# EAGLE design Battery_Monitoring_V3 (EAGLE 9.6.2)

## Sheet 1 of 3
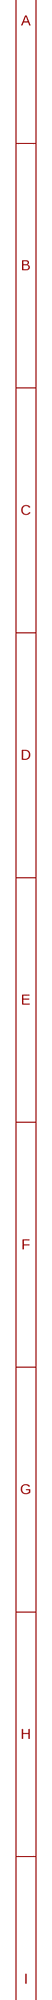
[diagram p0: schematic, sheet 1, part 1 of 2]
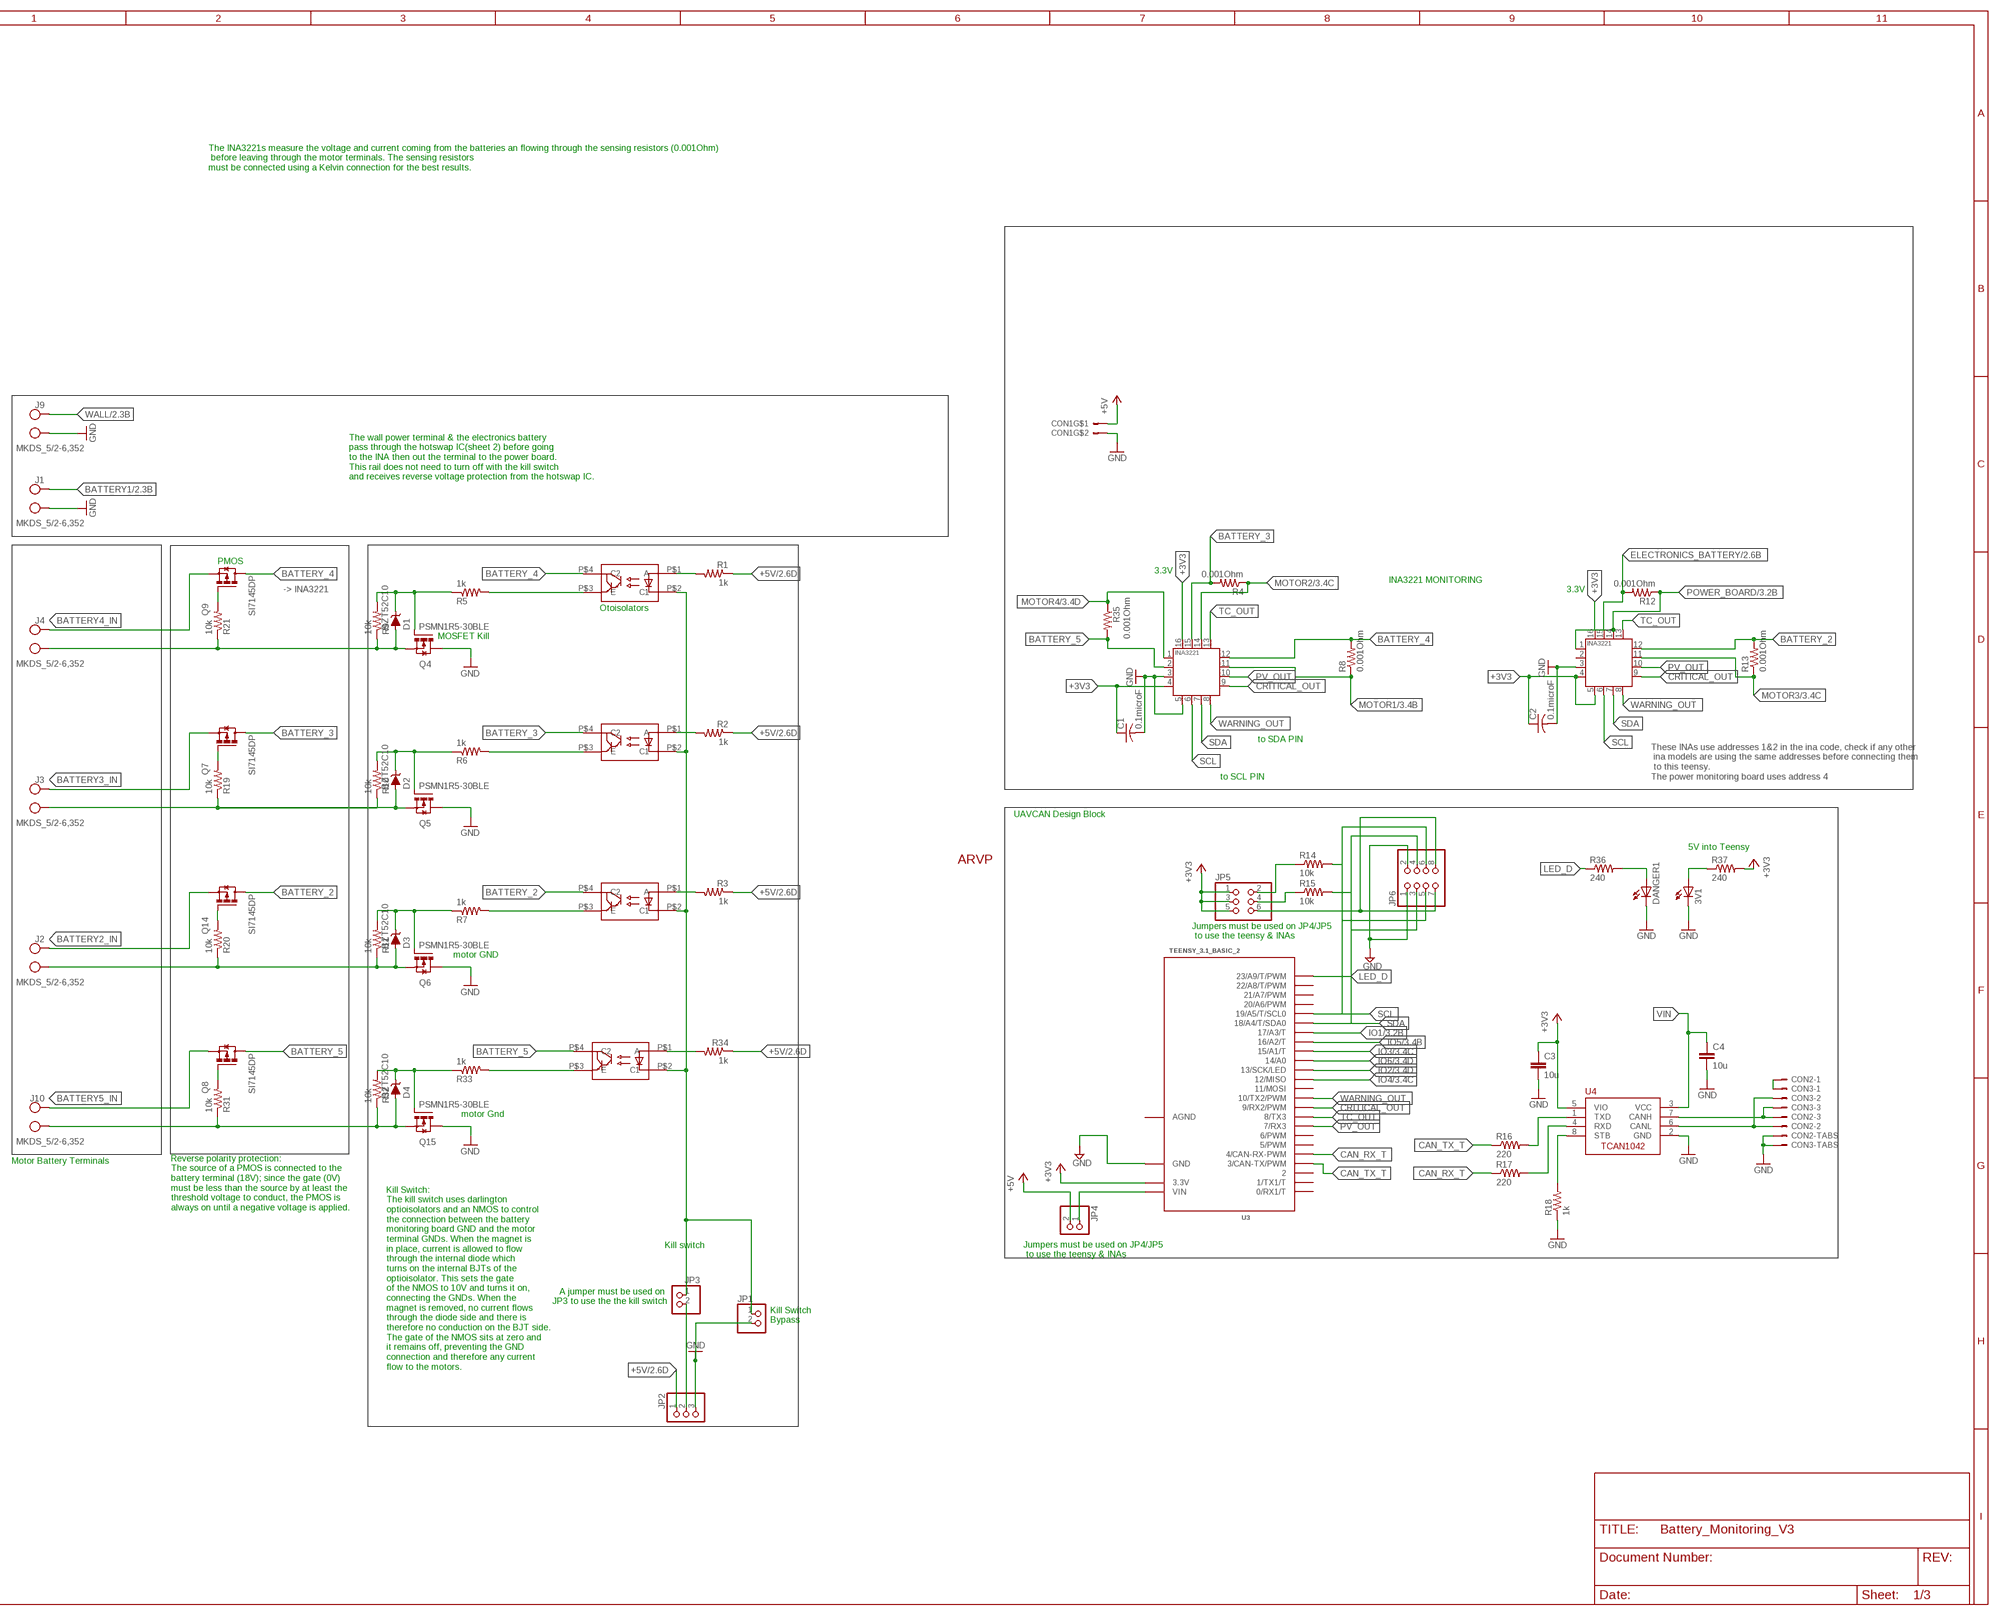
[diagram p1: schematic, sheet 1, part 2 of 2]

### Parts
3V1  LEDSMT1206  [1206]
ARVP1  ARVP_LOGO  [ARVP]
C1  0.1microF  C-USC2012  [C2012]
C2  0.1microF  C-USC2012  [C2012]
C3  10u  C-EUC0805  [C0805]
C4  10u  C-EUC0805  [C0805]
CON1  MOLEX_5566-2  [5566-2]
CON2  SM03B-GHS-TB  [SM03B-GHS-TB]
CON3  SM03B-GHS-TB  [SM03B-GHS-TB]
D1  BZT52C10  [SOD-123]
D2  BZT52C10  [SOD-123]
D3  BZT52C10  [SOD-123]
D4  BZT52C10  [SOD-123]
DANGER1  LEDSMT1206  [1206]
J1  MKDS_5/2-6,352  [MKDS_5/2-6,35]
J2  MKDS_5/2-6,352  [MKDS_5/2-6,35]
J3  MKDS_5/2-6,352  [MKDS_5/2-6,35]
J4  MKDS_5/2-6,352  [MKDS_5/2-6,35]
J9  MKDS_5/2-6,352  [MKDS_5/2-6,35]
J10  MKDS_5/2-6,352  [MKDS_5/2-6,35]
JP1  PINHD-1X2  [1X02]
JP2  PINHD-1X3  [1X03]
JP3  PINHD-1X2  [1X02]
JP4  PINHD-1X2  [1X02]
JP5  PINHD-2X3  [2X03]
JP6  PINHD-2X4  [2X04]
Q1  TCLD1000CT  [SOP-4L]
Q2  TCLD1000CT  [SOP-4L]
Q3  TCLD1000CT  [SOP-4L]
Q4  PSMN1R5-30BLE  [SOT404/D2PAK]
Q5  PSMN1R5-30BLE  [SOT404/D2PAK]
Q6  PSMN1R5-30BLE  [SOT404/D2PAK]
Q7  SI7145DP  [SO-8/PPAK/TEST]
Q8  SI7145DP  [SO-8/PPAK/TEST]
Q9  SI7145DP  [SO-8/PPAK/TEST]
Q14  SI7145DP  [SO-8/PPAK/TEST]
Q15  PSMN1R5-30BLE  [SOT404/D2PAK]
Q16  TCLD1000CT  [SOP-4L]
R1  1k  R-US_R0805  [R0805]
R2  1k  R-US_R0805  [R0805]
R3  1k  R-US_R0805  [R0805]
R4  0.001Ohm  HCS3920FT1L00  [3920]
R5  1k  R-US_M1206  [M1206]
R6  1k  R-US_M1206  [M1206]
R7  1k  R-US_M1206  [M1206]
R8  0.001Ohm  HCS3920FT1L00  [3920]
R9  10k  R-US_M1206  [M1206]
R10  10k  R-US_M1206  [M1206]
R11  10k  R-US_M1206  [M1206]
R12  0.001Ohm  HCS3920FT1L00  [3920]
R13  0.001Ohm  HCS3920FT1L00  [3920]
R14  10k  R-US_R1206  [R1206]
R15  10k  R-US_R1206  [R1206]
R16  220  R-US_R0805  [R0805]
R17  220  R-US_R0805  [R0805]
R18  1k  R-US_R0805  [R0805]
R19  10k  R-US_M1206  [M1206]
R20  10k  R-US_M1206  [M1206]
R21  10k  R-US_M1206  [M1206]
R31  10k  R-US_M1206  [M1206]
R32  10k  R-US_M1206  [M1206]
R33  1k  R-US_M1206  [M1206]
R34  1k  R-US_R0805  [R0805]
R35  0.001Ohm  HCS3920FT1L00  [3920]
R36  240  R-US_R1206  [R1206]
R37  240  R-US_R1206  [R1206]
U1  INA3221.  [HVQFN16_4X4]
U2  INA3221.  [HVQFN16_4X4]
U3  TEENSY_3.1_BASIC_2  [TEENSY_3.1_BASIC_2]
U4  TCAN1042HVDR  [SO-8]

### Nets
+3V3: C1.1 C2.1 C3.1 JP5.1 JP5.3 JP5.5 R37.2 U1.4(VS) U1.16(VPU) U2.4(VS) U2.5(A0) U2.16(VPU) U3.3.3V U4.5(VIO)
+5V: CON1.1 JP2.1 JP4.2 R1.1 R2.1 R3.1 R34.1 ; also sheet 2,3
BATT1GND: D1.P$2(A) J4.1(KL) Q4.3S(S) R9.1 R21.1
BATT2GND: D2.P$2(A) J3.1(KL) Q5.3S(S) R10.1 R19.1
BATT3GND: D3.P$2(A) J2.1(KL) Q6.3S(S) R11.1 R20.1
BATT5GND: D4.P$2(A) J10.1(KL) Q15.3S(S) R31.1 R32.1
BATTERY1: J1.2(KL1) ; also sheet 2
BATTERY2_IN: J2.2(KL1) Q14.S@1(S) Q14.S@2(S) Q14.S@3(S)
BATTERY3_IN: J3.2(KL1) Q7.S@1(S) Q7.S@2(S) Q7.S@3(S)
BATTERY4_IN: J4.2(KL1) Q9.S@1(S) Q9.S@2(S) Q9.S@3(S)
BATTERY5_IN: J10.2(KL1) Q8.S@1(S) Q8.S@2(S) Q8.S@3(S)
BATTERY_2: Q3.P$4(C2) Q14.D@1(D) Q14.D@2(D) Q14.D@3(D) Q14.D@4(D) Q14.D@5(D) R13.P$2 U2.12(IN+1)
BATTERY_3: Q2.P$4(C2) Q7.D@1(D) Q7.D@2(D) Q7.D@3(D) Q7.D@4(D) Q7.D@5(D) R4.P$2 U1.15(IN+2)
BATTERY_4: Q1.P$4(C2) Q9.D@1(D) Q9.D@2(D) Q9.D@3(D) Q9.D@4(D) Q9.D@5(D) R8.P$2 U1.12(IN+1)
BATTERY_5: Q8.D@1(D) Q8.D@2(D) Q8.D@3(D) Q8.D@4(D) Q8.D@5(D) Q16.P$4(C2) R35.P$2 U1.2(IN+3)
CAN_RX1: R17.2 U4.4(RXD)
CAN_RX_T: R17.1 U3.4(4/CAN-RX-PWM)
CAN_TX2: R16.2 U4.1(TXD)
CAN_TX_T: R16.1 U3.3(3/CAN-TX/PWM)
CANH1: CON2.P$3 CON3.P$3 U4.7(CANH)
CANL1: CON2.P$2 CON3.P$2 U4.6(CANL)
CANSH1: CON2.P$1 CON3.P$1
CRITICAL_OUT: U1.9(CRITICAL) U2.9(CRITICAL) U3.9(9/RX2/PWM)
E1: Q1.P$3(E) R5.2
E2: Q2.P$3(E) R6.2
E3: Q3.P$3(E) R7.2
ELECTRONICS_BATTERY: R12.P$2 U2.15(IN+2) ; also sheet 2
GND: 3V1.C C1.2 C2.2 C3.2 C4.2 CON1.2 CON2.P$4 CON2.P$5 CON3.P$4 CON3.P$5 DANGER1.C J1.1(KL) J9.1(KL) JP1.2 JP2.3 JP6.1 JP6.2 Q4.2D(D) Q5.2D(D) Q6.2D(D) Q15.2D(D) R18.1 U1.3(GND) U1.5(A0) U2.3(GND) U3.GND U4.2(GND) ; also sheet 2,3
I2C_3V1: JP5.6 JP6.7 JP6.8
IO1: U3.17/A3(17/A3/T) ; also sheet 3
IO2: U3.13(13/SCK/LED) ; also sheet 3
IO3: U3.15/A1(15/A1/T) ; also sheet 3
IO4: U3.12(12/MISO) ; also sheet 3
IO5: U3.16/A2(16/A2/T) ; also sheet 3
IO6: U3.14/A0 ; also sheet 3
LED_D: R36.1 U3.23/A9(23/A9/T/PWM)
MG1: D1.P$1(C) Q4.1G(G) R5.1 R9.2
MG2: D2.P$1(C) Q5.1G(G) R6.1 R10.2
MG3: D3.P$1(C) Q6.1G(G) R7.1 R11.2
MG4: D4.P$1(C) Q15.1G(G) R32.2 R33.1
MOTOR1: R8.P$1 U1.11(IN-1) ; also sheet 3
MOTOR2: R4.P$1 U1.14(IN-2) ; also sheet 3
MOTOR3: R13.P$1 U2.11(IN-1) ; also sheet 3
MOTOR4: R35.P$1 U1.1(IN-3) ; also sheet 3
N$1: Q1.P$1(A) R1.2
N$2: Q2.P$1(A) R2.2
N$3: Q3.P$1(A) R3.2
N$4: JP1.1 JP3.1 Q1.P$2(C1) Q2.P$2(C1) Q3.P$2(C1) Q16.P$2(C1)
N$5: JP2.2 JP3.2
N$6: Q7.G R19.2
N$7: Q14.G R20.2
N$9: Q9.G R21.2
N$10: Q8.G R31.2
N$15: Q16.P$3(E) R33.2
N$16: Q16.P$1(A) R34.2
N$22: 3V1.A R37.1
N$23: DANGER1.A R36.2
POWER_BOARD: R12.P$1 U2.1(IN-3) U2.14(IN-2) ; also sheet 3
PV_OUT: U1.10(PV) U2.10(PV) U3.7(7/RX3)
SCL: JP6.5 JP6.6 R14.2 U1.6(SCL) U2.6(SCL) U3.19/A5(19/A5/T/SCL0)
SCL_3V1: JP5.2 R14.1
SDA: JP6.3 JP6.4 R15.2 U1.7(SDA) U2.7(SDA) U3.18/A4(18/A4/T/SDA0)
SDA_3V1: JP5.4 R15.1
STB1: R18.2 U4.8(STB)
TC_OUT: U1.13(TC) U2.13(TC) U3.8(8/TX3)
VIN: C4.1 JP4.1 U3.VIN U4.3(VCC)
WALL: J9.2(KL1) ; also sheet 2
WARNING_OUT: U1.8(WARNING) U2.8(WARNING) U3.10(10/TX2/PWM)
Unconnected: U2.2(IN+3) U3.0(0/RX1/T) U3.1(1/TX1/T) U3.2 U3.5(5/PWM) U3.6(6/PWM) U3.11(11/MOSI) U3.20/A6(20/A6/PWM) U3.21/A7(21/A7/PWM) U3.22/A8(22/A8/T/PWM)

### Notes on the sheet
- The INA3221s measure the voltage and current coming from the batteries an flowing through the sensing resistors (0.001Ohm)
   before leaving through the motor terminals. The sensing resistors
  must be connected using a Kelvin connection for the best results.
- The wall power terminal & the electronics battery
  pass through the hotswap IC(sheet 2) before going 
  to the INA then out the terminal to the power board. 
  This rail does not need to turn off with the kill switch 
  and receives reverse voltage protection from the hotswap IC.
- PMOS
- 3.3V
- INA3221 MONITORING
- -> INA3221 | 3.3V
- Otoisolators
- MOSFET Kill
- to SDA PIN
- to SCL PIN
- These INAs use addresses 1&2 in the ina code, check if any other
   ina models are using the same addresses before connecting them
   to this teensy.
  The power monitoring board uses address 4
- UAVCAN Design Block
- 5V into Teensy
- Jumpers must be used on JP4/JP5
   to use the teensy & INAs
- motor GND
- motor Gnd
- Motor Battery Terminals
- Reverse polarity protection:
  The source of a PMOS is connected to the 
  battery terminal (18V); since the gate (0V) 
  must be less than the source by at least the 
  threshold voltage to conduct, the PMOS is 
  always on until a negative voltage is applied.
- Kill switch
- Jumpers must be used on JP4/JP5
   to use the teensy & INAs
- A jumper must be used on 
  JP3 to use the the kill switch
- Kill Switch 
  Bypass
- Kill Switch:
  The kill switch uses darlington 
  optioisolators and an NMOS to control 
  the connection between the battery 
  monitoring board GND and the motor 
  terminal GNDs. When the magnet is 
  in place, current is allowed to flow 
  through the internal diode which 
  turns on the internal BJTs of the 
  optioisolator. This sets the gate
  of the NMOS to 10V and turns it on,
  connecting the GNDs. When the 
  magnet is removed, no current flows 
  through the diode side and there is 
  therefore no conduction on the BJT side. 
  The gate of the NMOS sits at zero and 
  it remains off, preventing the GND 
  connection and therefore any current 
  flow to the motors.

## Sheet 2 of 3
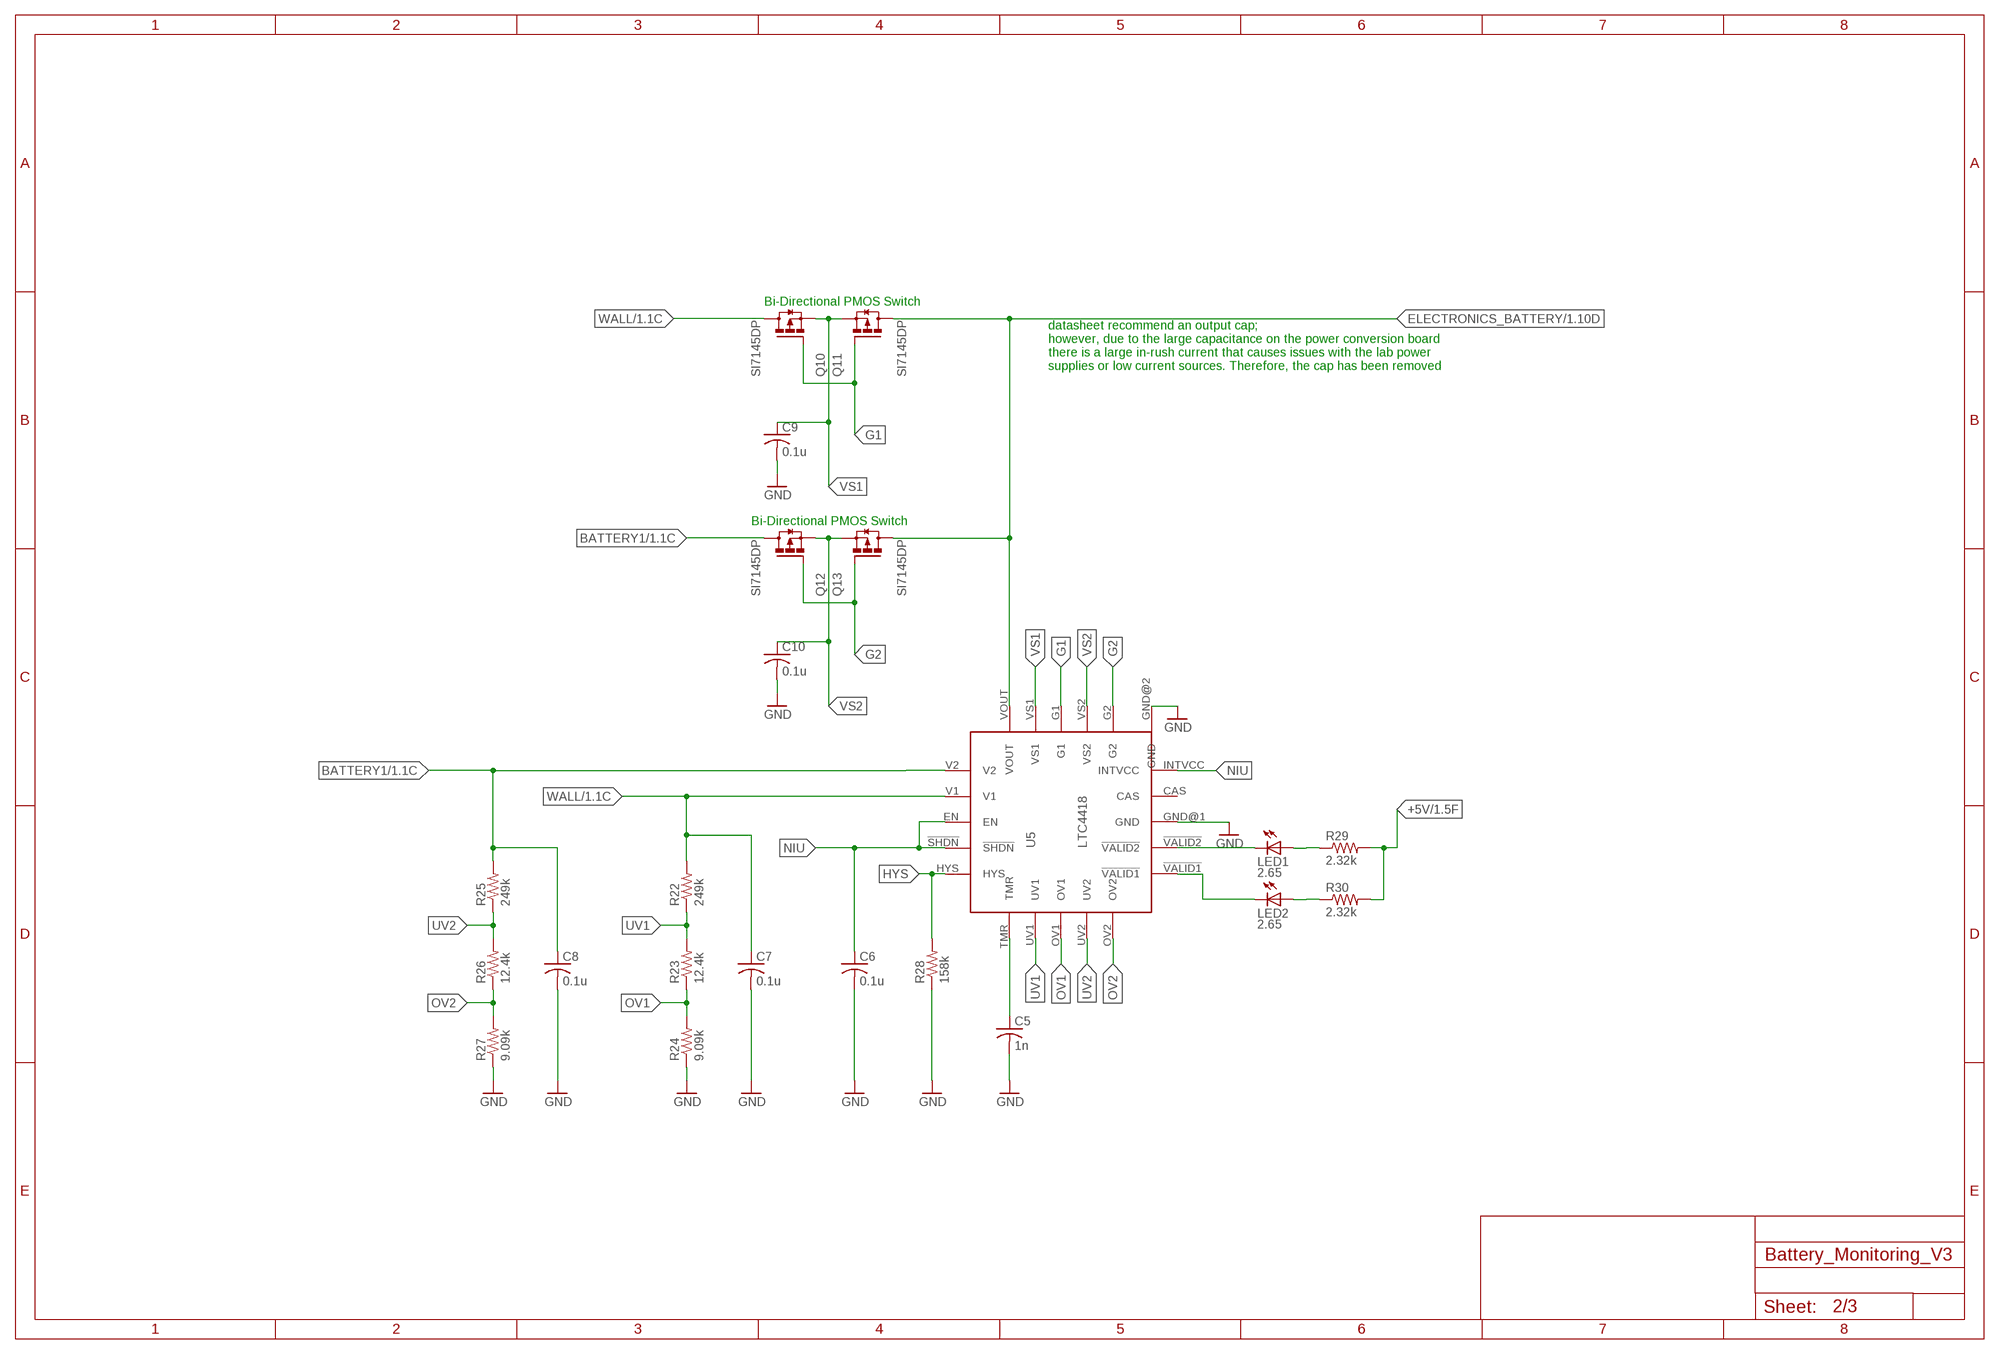
[diagram p2: schematic, sheet 2]

### Parts
C5  1n  C-USC0805  [C0805]
C6  0.1u  C-USC0805  [C0805]
C7  0.1u  C-USC0805  [C0805]
C8  0.1u  C-USC0805  [C0805]
C9  0.1u  C-USC0805  [C0805]
C10  0.1u  C-USC0805  [C0805]
LED1  2.65  LEDSML0805  [SML0805]
LED2  2.65  LEDSML0805  [SML0805]
Q10  SI7145DP  [SO-8/PPAK/TEST]
Q11  SI7145DP  [SO-8/PPAK/TEST]
Q12  SI7145DP  [SO-8/PPAK/TEST]
Q13  SI7145DP  [SO-8/PPAK/TEST]
R22  249k  R-US_R1206  [R1206]
R23  12.4k  R-US_R0805  [R0805]
R24  9.09k  R-US_R0805  [R0805]
R25  249k  R-US_R1206  [R1206]
R26  12.4k  R-US_R0805  [R0805]
R27  9.09k  R-US_R0805  [R0805]
R28  158k  R-US_R0805  [R0805]
R29  2.32k  R-US_R0805  [R0805]
R30  2.32k  R-US_R0805  [R0805]
U5  LTC4418  [20-QFN(4X4)]

### Nets
!VALID1: LED2.C U5.!VALID1
!VALID2: LED1.C U5.!VALID2
+5V: R29.2 R30.2 ; also sheet 1,3
BATTERY1: C8.1 Q12.D@1(D) Q12.D@2(D) Q12.D@3(D) Q12.D@4(D) Q12.D@5(D) R25.2 U5.V2 ; also sheet 1
ELECTRONICS_BATTERY: Q11.D@1(D) Q11.D@2(D) Q11.D@3(D) Q11.D@4(D) Q11.D@5(D) Q13.D@1(D) Q13.D@2(D) Q13.D@3(D) Q13.D@4(D) Q13.D@5(D) U5.VOUT ; also sheet 1
G1: Q10.G Q11.G U5.G1
G2: Q12.G Q13.G U5.G2
GND: C5.2 C6.2 C7.2 C8.2 C9.2 C10.2 R24.1 R27.1 R28.1 U5.GND@1(GND) U5.GND@2(GND) ; also sheet 1,3
HYS: R28.2 U5.HYS
N$8: LED1.A R29.1
N$11: LED2.A R30.1
N$14: C5.1 U5.TMR
NIU: C6.1 U5.!SHDN U5.EN U5.INTVCC
OV1: R23.1 R24.2 U5.OV1
OV2: R26.1 R27.2 U5.OV2
UV1: R22.1 R23.2 U5.UV1
UV2: R25.1 R26.2 U5.UV2
VS1: C9.1 Q10.S@1(S) Q10.S@2(S) Q10.S@3(S) Q11.S@1(S) Q11.S@2(S) Q11.S@3(S) U5.VS1
VS2: C10.1 Q12.S@1(S) Q12.S@2(S) Q12.S@3(S) Q13.S@1(S) Q13.S@2(S) Q13.S@3(S) U5.VS2
WALL: C7.1 Q10.D@1(D) Q10.D@2(D) Q10.D@3(D) Q10.D@4(D) Q10.D@5(D) R22.2 U5.V1 ; also sheet 1
Unconnected: U5.CAS

### Notes on the sheet
- Bi-Directional PMOS Switch
- datasheet recommend an output cap;
  however, due to the large capacitance on the power conversion board 
  there is a large in-rush current that causes issues with the lab power 
  supplies or low current sources. Therefore, the cap has been removed
- Bi-Directional PMOS Switch

## Sheet 3 of 3
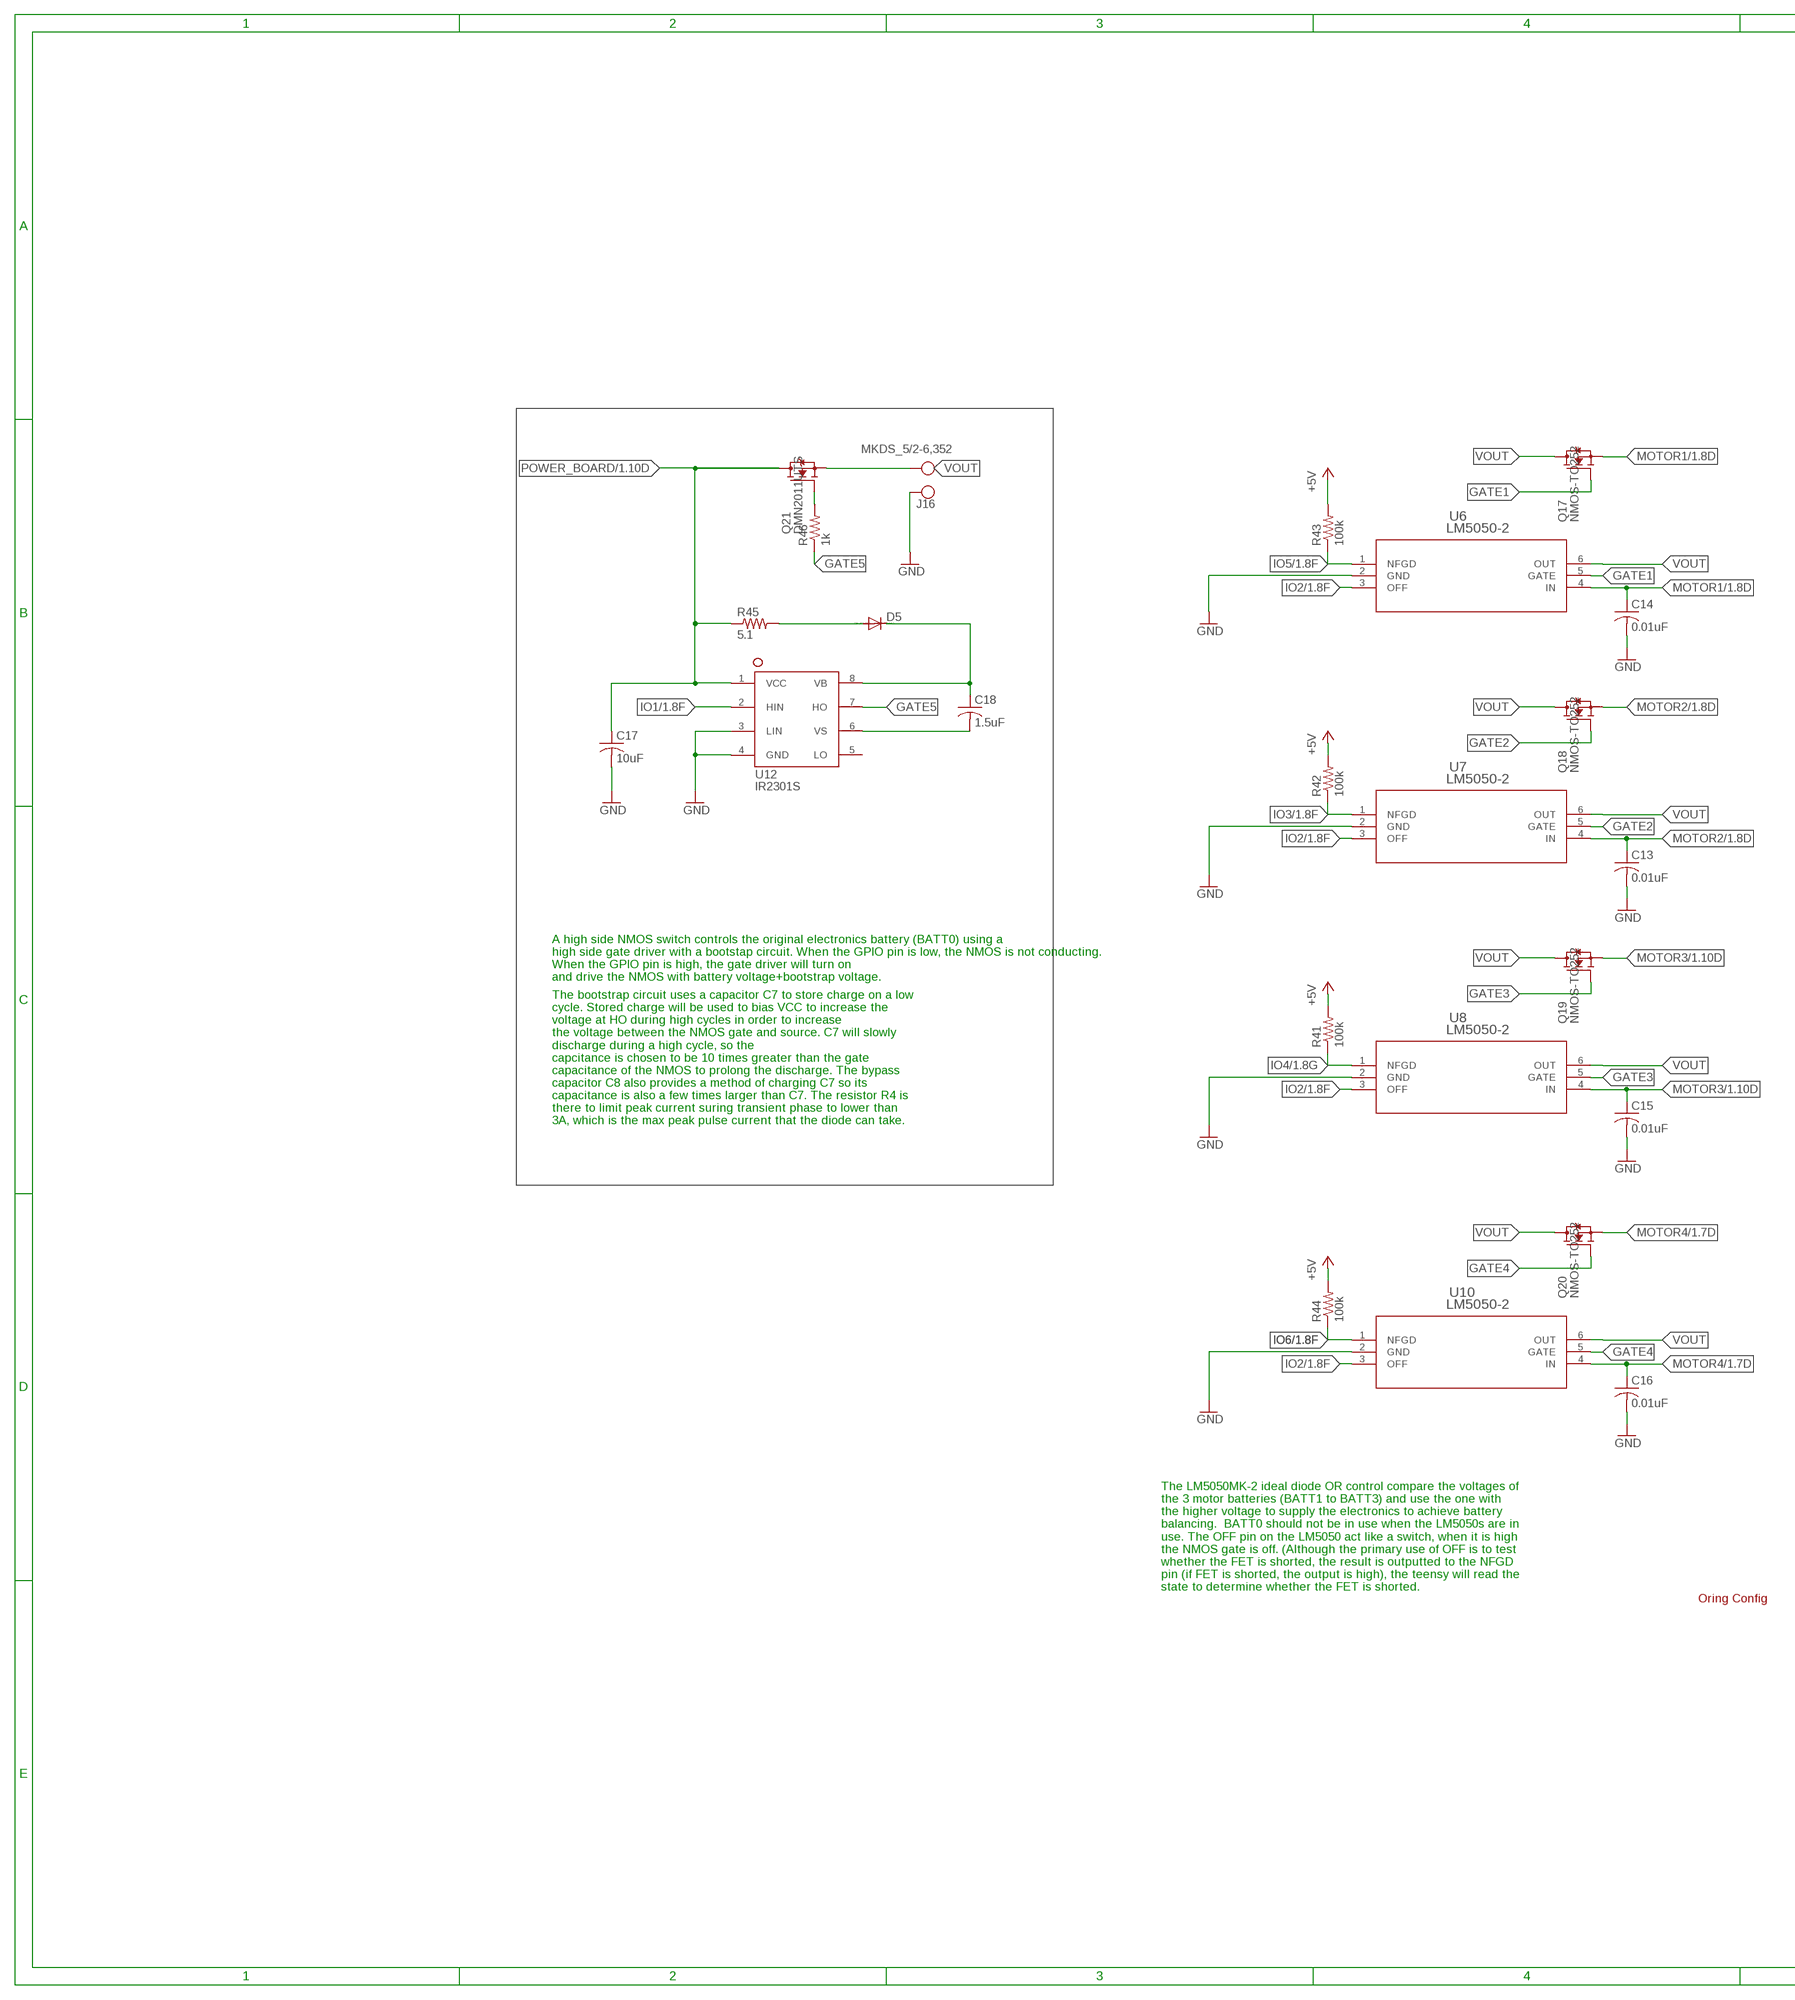
[diagram p3: schematic, sheet 3, part 1 of 2]
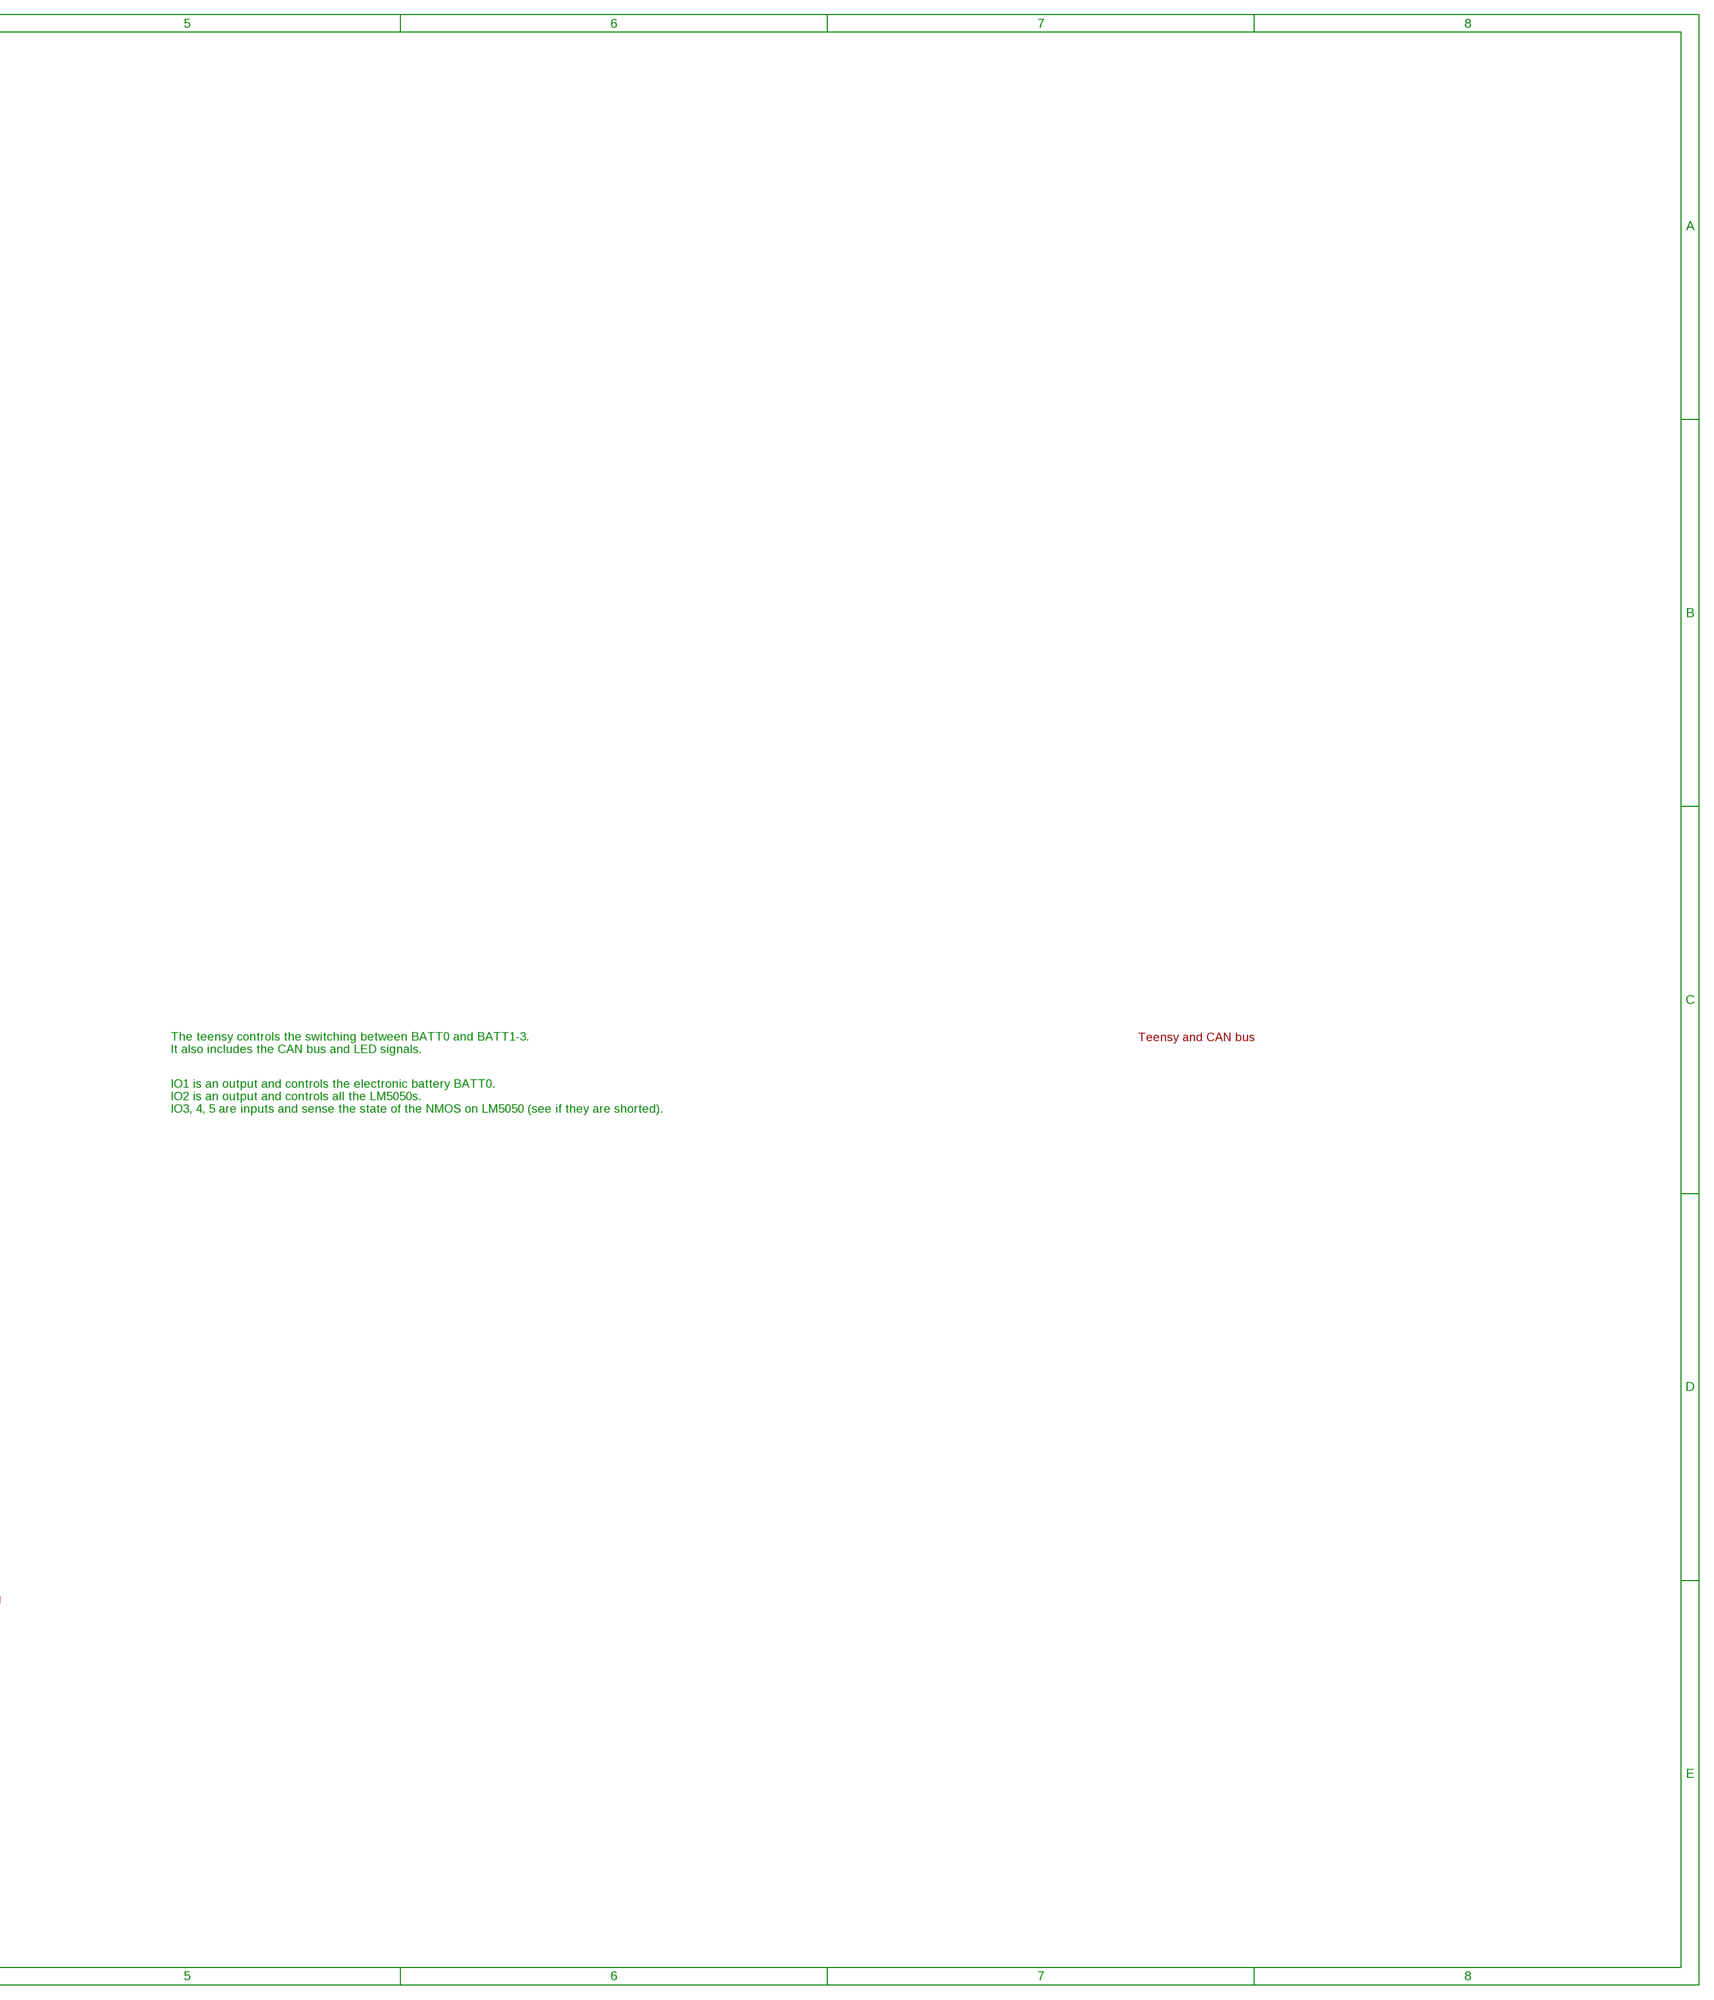
[diagram p4: schematic, sheet 3, part 2 of 2]

### Parts
C13  0.01uF  C-USC0805  [C0805]
C14  0.01uF  C-USC0805  [C0805]
C15  0.01uF  C-USC0805  [C0805]
C16  0.01uF  C-USC0805  [C0805]
C17  10uF  C-USC1206  [C1206]
C18  1.5uF  C-USC0805  [C0805]
D5  DIODE-DO-214AC  [DO-214AC]
J16  MKDS_5/2-6,352  [MKDS_5/2-6,35]
Q17  NMOS-TO252  [TO252]
Q18  NMOS-TO252  [TO252]
Q19  NMOS-TO252  [TO252]
Q20  NMOS-TO252  [TO252]
Q21  DMN2011UTS  [SOP65P640X120-8N]
R41  100k  R-US_R1206  [R1206]
R42  100k  R-US_R1206  [R1206]
R43  100k  R-US_R1206  [R1206]
R44  100k  R-US_R1206  [R1206]
R45  5.1  R-US_R1206  [R1206]
R46  1k  R-US_R0805  [R0805]
U6  LM5050-2  [MK06A]
U7  LM5050-2  [MK06A]
U8  LM5050-2  [MK06A]
U10  LM5050-2  [MK06A]
U12  IR2301S  [SOIC8]

### Nets
+5V: R41.2 R42.2 R43.2 R44.2 ; also sheet 1,2
GATE1: Q17.1(G) U6.5(GATE)
GATE2: Q18.1(G) U7.5(GATE)
GATE3: Q19.1(G) U8.5(GATE)
GATE4: Q20.1(G) U10.5(GATE)
GATE5: R46.1 U12.7(HO)
GND: C13.2 C14.2 C15.2 C16.2 C17.2 J16.2(KL1) U6.2(GND) U7.2(GND) U8.2(GND) U10.2(GND) U12.3(LIN) U12.4(GND) ; also sheet 1,2
IO1: U12.2(HIN) ; also sheet 1
IO2: U6.3(OFF) U7.3(OFF) U8.3(OFF) U10.3(OFF) ; also sheet 1
IO3: R42.1 U7.1(NFGD) ; also sheet 1
IO4: R41.1 U8.1(NFGD) ; also sheet 1
IO5: R43.1 U6.1(NFGD) ; also sheet 1
IO6: R44.1 U10.1(NFGD) ; also sheet 1
MOTOR1: C14.1 Q17.3(S) U6.4(IN) ; also sheet 1
MOTOR2: C13.1 Q18.3(S) U7.4(IN) ; also sheet 1
MOTOR3: C15.1 Q19.3(S) U8.4(IN) ; also sheet 1
MOTOR4: C16.1 Q20.3(S) U10.4(IN) ; also sheet 1
N$18: C18.2 U12.6(VS)
N$19: C18.1 D5.C U12.8(VB)
N$20: Q21.4(G) R46.2
N$21: D5.A R45.2
POWER_BOARD: C17.1 Q21.5(D) Q21.6(D) Q21.7(D) Q21.8(D) R45.1 U12.1(VCC) ; also sheet 1
VOUT: J16.1(KL) Q17.2(D) Q18.2(D) Q19.2(D) Q20.2(D) Q21.1(S) Q21.2(S) Q21.3(S) U6.6(OUT) U7.6(OUT) U8.6(OUT) U10.6(OUT)
Unconnected: U12.5(LO)

### Notes on the sheet
- A high side NMOS switch controls the original electronics battery (BATT0) using a
  high side gate driver with a bootstap circuit. When the GPIO pin is low, the NMOS is not conducting. 
  When the GPIO pin is high, the gate driver will turn on
  and drive the NMOS with battery voltage+bootstrap voltage.
- Teensy and CAN bus
- The teensy controls the switching between BATT0 and BATT1-3.
  It also includes the CAN bus and LED signals.
- IO1 is an output and controls the electronic battery BATT0.
  IO2 is an output and controls all the LM5050s.
  IO3, 4, 5 are inputs and sense the state of the NMOS on LM5050 (see if they are shorted).
- The bootstrap circuit uses a capacitor C7 to store charge on a low 
  cycle. Stored charge will be used to bias VCC to increase the
  voltage at HO during high cycles in order to increase 
  the voltage between the NMOS gate and source. C7 will slowly 
  discharge during a high cycle, so the
  capcitance is chosen to be 10 times greater than the gate
  capacitance of the NMOS to prolong the discharge. The bypass
  capacitor C8 also provides a method of charging C7 so its
  capacitance is also a few times larger than C7. The resistor R4 is
  there to limit peak current suring transient phase to lower than
  3A, which is the max peak pulse current that the diode can take.
- The LM5050MK-2 ideal diode OR control compare the voltages of
  the 3 motor batteries (BATT1 to BATT3) and use the one with
  the higher voltage to supply the electronics to achieve battery
  balancing.  BATT0 should not be in use when the LM5050s are in
  use. The OFF pin on the LM5050 act like a switch, when it is high
  the NMOS gate is off. (Although the primary use of OFF is to test
  whether the FET is shorted, the result is outputted to the NFGD
  pin (if FET is shorted, the output is high), the teensy will read the
  state to determine whether the FET is shorted.
- Oring Config

## Power pins joined to a net without a drawn wire
AGND: U3.AGND

## Library data of the parts
3V1 DANGER1 = adafruit:LED: LED
ARVP1 = ARVP:ARVP_LOGO
C1 C2 = resistor:C-US: CAPACITOR, American symbol
C3 C4 = rcl:C-EU: CAPACITOR, European symbol
C5-C10 C13-C18 = adafruit:C-US: CAPACITOR, American symbol
CON1 = ARVP:MOLEX_5566-2
CON2 CON3 = ARVP:SM03B-GHS-TB
D1-D4 = Moira:BZT52C10: DIODE ZENER 10V 500MW SOD123 by Diodes Incorporated Digikey: BZT52C10-FDICT-ND
D5 = diode:DIODE-: DIODE
J1-J4 J9 J10 J16 = Moira:MKDS_5/2-6,35: CONN TERM BLOCK 2POS 6.35MM PCB, 2 Position Wire to Board Terminal Block Horizontal with Board 0.250" (6.35mm) Through Hole, Phoenix Contact (1714955), Digikey:277-1269-ND, MKDS 5/2-6,35 package adpated from Eagle library package MKDS 5/3-6,35
JP1 JP3 JP4 = pinhead:PINHD-1X2: PIN HEADER
JP2 = pinhead:PINHD-1X3: PIN HEADER
JP5 = pinhead:PINHD-2X3: PIN HEADER
JP6 = pinhead:PINHD-2X4: PIN HEADER
LED1 LED2 = led:LED: LED
Q1 = Moira:TCLD1000CT: OPTOISOLTR 5KV DARLINGTON 4-SOP by VISHAY Digikey: TCLD1000CT_ND; SPICEPREFIX: E
Q2 Q3 Q16 = Moira:TCLD1000CT: OPTOISOLTR 5KV DARLINGTON 4-SOP by VISHAY Digikey: TCLD1000CT_ND
Q4-Q6 Q15 = Moira:PSMN1R5-30BLE: N-channel 30 V 1.5 mΩ logic level MOSFET in D2PAK by Nexperia USA Inc. Digikey: 1727-1101-1-ND
Q7-Q9 Q14 = Si7145DP:SI7145DP: MOSFET P-CH 30V 60A PPAK SO-8 Digikey: SI7145DP-T1-GE3CT-ND; MPN: SI7145DP-T1-GE3; OC_NEWARK: 63R6006
Q10-Q13 = Moira:SI7145DP: MOSFET P-CH 30V 60A PPAK SO-8 Digikey: SI7145DP-T1-GE3CT-ND
Q17-Q20 = AlbertaSat:NMOS-TO252
Q21 = Lydia:DMN2011UTS: MOSFET N-CH 20V 21A 8-TSSOP 20V 21A (Tc) 1.3W (Ta)
R1-R3 R5-R7 R9-R11 R22-R30 R32-R34 R41-R45 = adafruit:R-US_: RESISTOR, American symbol
R4 R8 R12 R13 R35 = Moira:HCS3920: 0.001 Ohm ±1% 5W Chip Resistor 4020 Automotive AEC-Q200, Current Sense, Moisture Resistant Metal Element Stackpole Electronics Inc. Digikey: HCS3920FT1L00CT-ND
R14-R18 R46 = rcl:R-US_: RESISTOR, American symbol
R19-R21 R31 = adafruit:R-US_: RESISTOR, American symbol; MPN: RC0603FR-0710KL; OC_NEWARK: 68R0049
R36 R37 = resistor:R-US_: RESISTOR, American symbol
U1 U2 = INA3221:INA3221: The INA3221 is a three-channel, high-side current and bus voltage monitor with an I 2C- and SMBUScompatible interface. The INA3221 monitors both shunt voltage drops and bus supply voltages, in addition to having programmable conversion times and averaging modes for these signals. The INA3221 offers both critical and warning alerts to detect multiple programmable out-of-range conditions for each channel.
U3 = Teensy_3_Series_Board_v1.0:TEENSY_3.1_BASIC_2: Footprint for Teensy 3.1 board using all pin connections on the outer perimeter
U4 = ARVP:TCAN1042HVDR
U5 = Moira:LTC4418: OR Controller Source Selector Switch P-Channel 2:1 20-QFN (4x4) Digikey: LTC4418IUF#PBF-ND
U6-U8 U10 = AlbertaSat:LM5050-2
U12 = Lydia:IR2301S

## Net classes
1 net1: clearance 0.203 mm to class 0

## Board
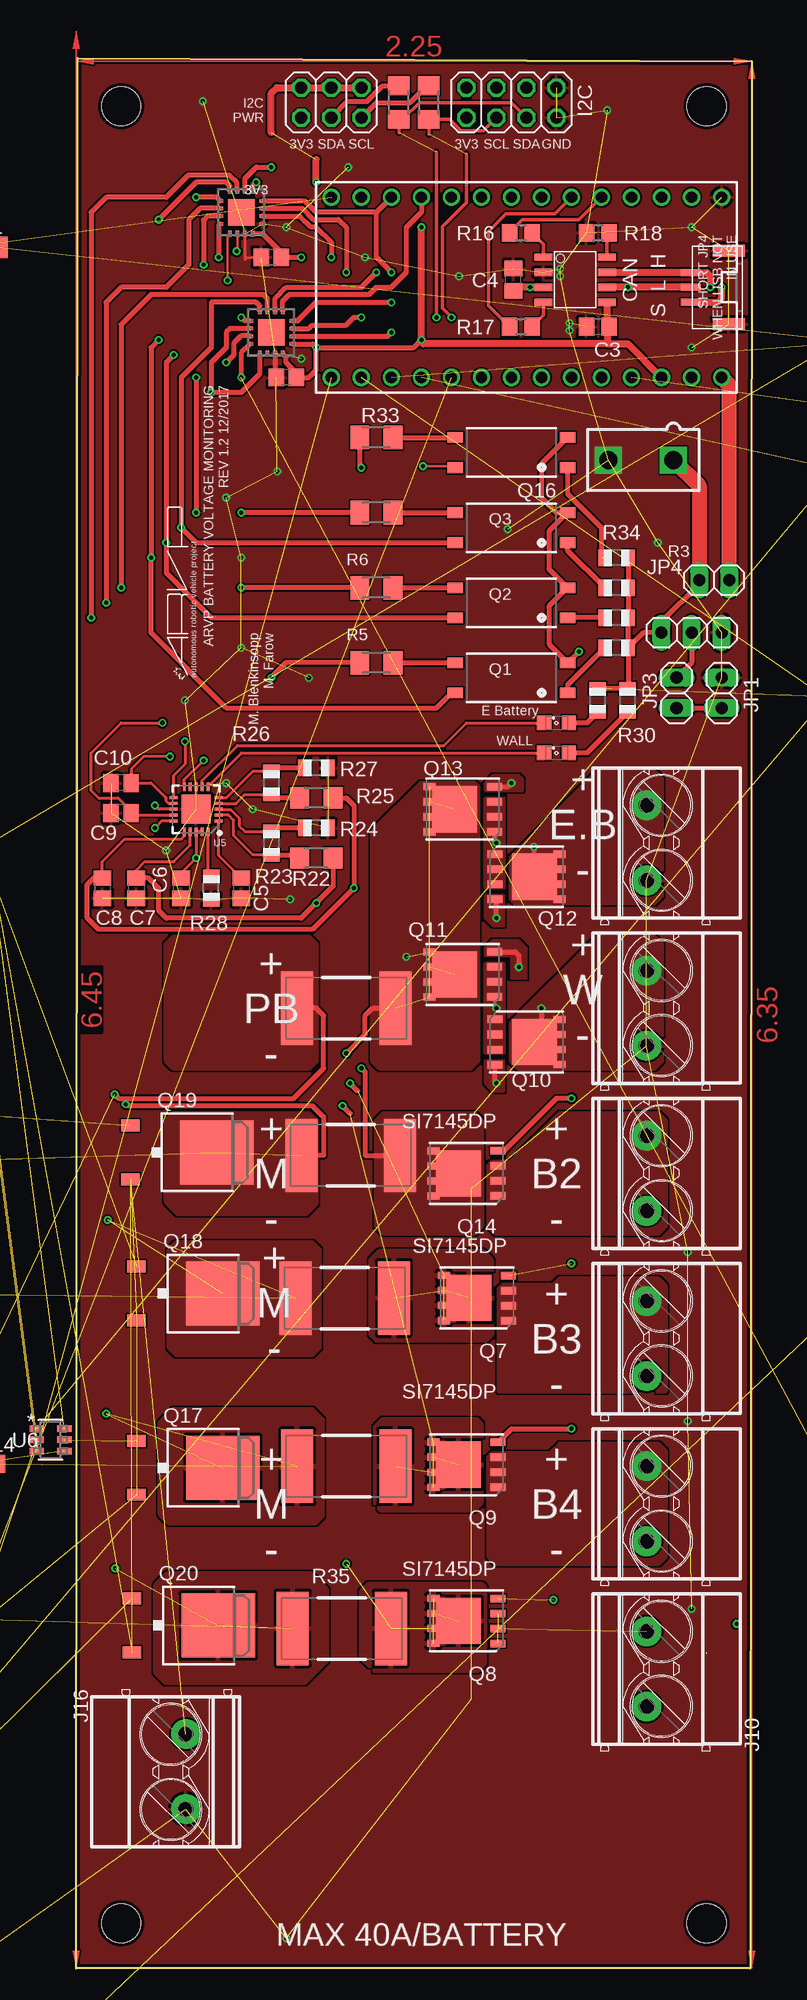
[diagram p5: board, top side]
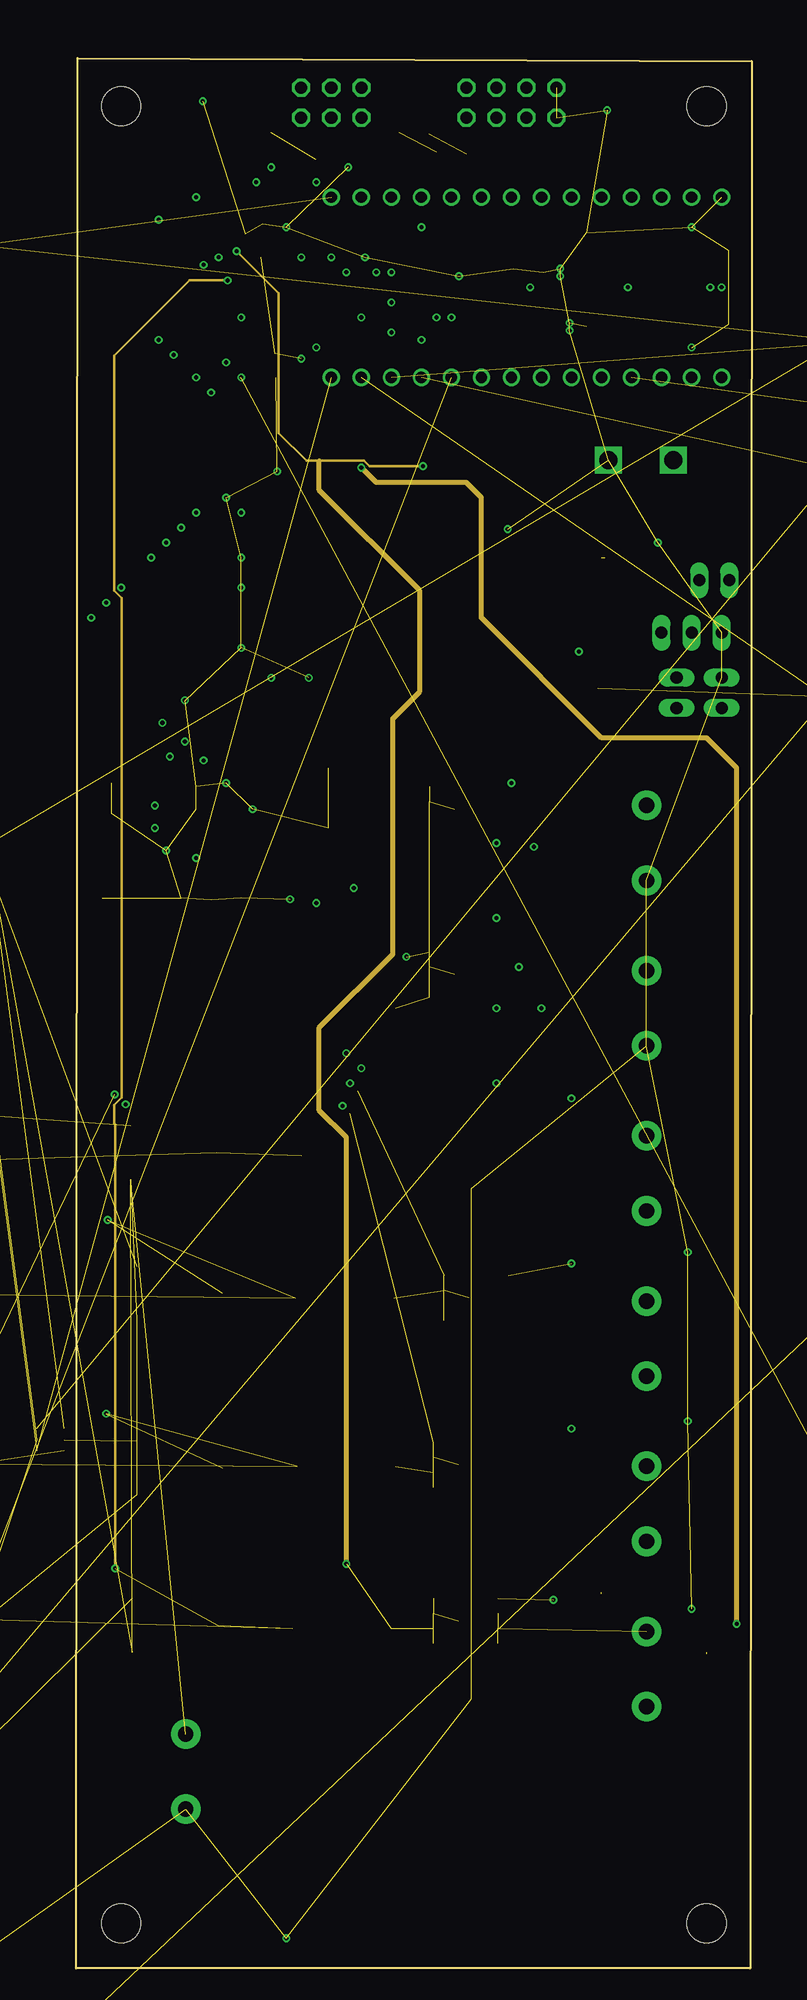
[diagram p6: board, inner layer Route2]
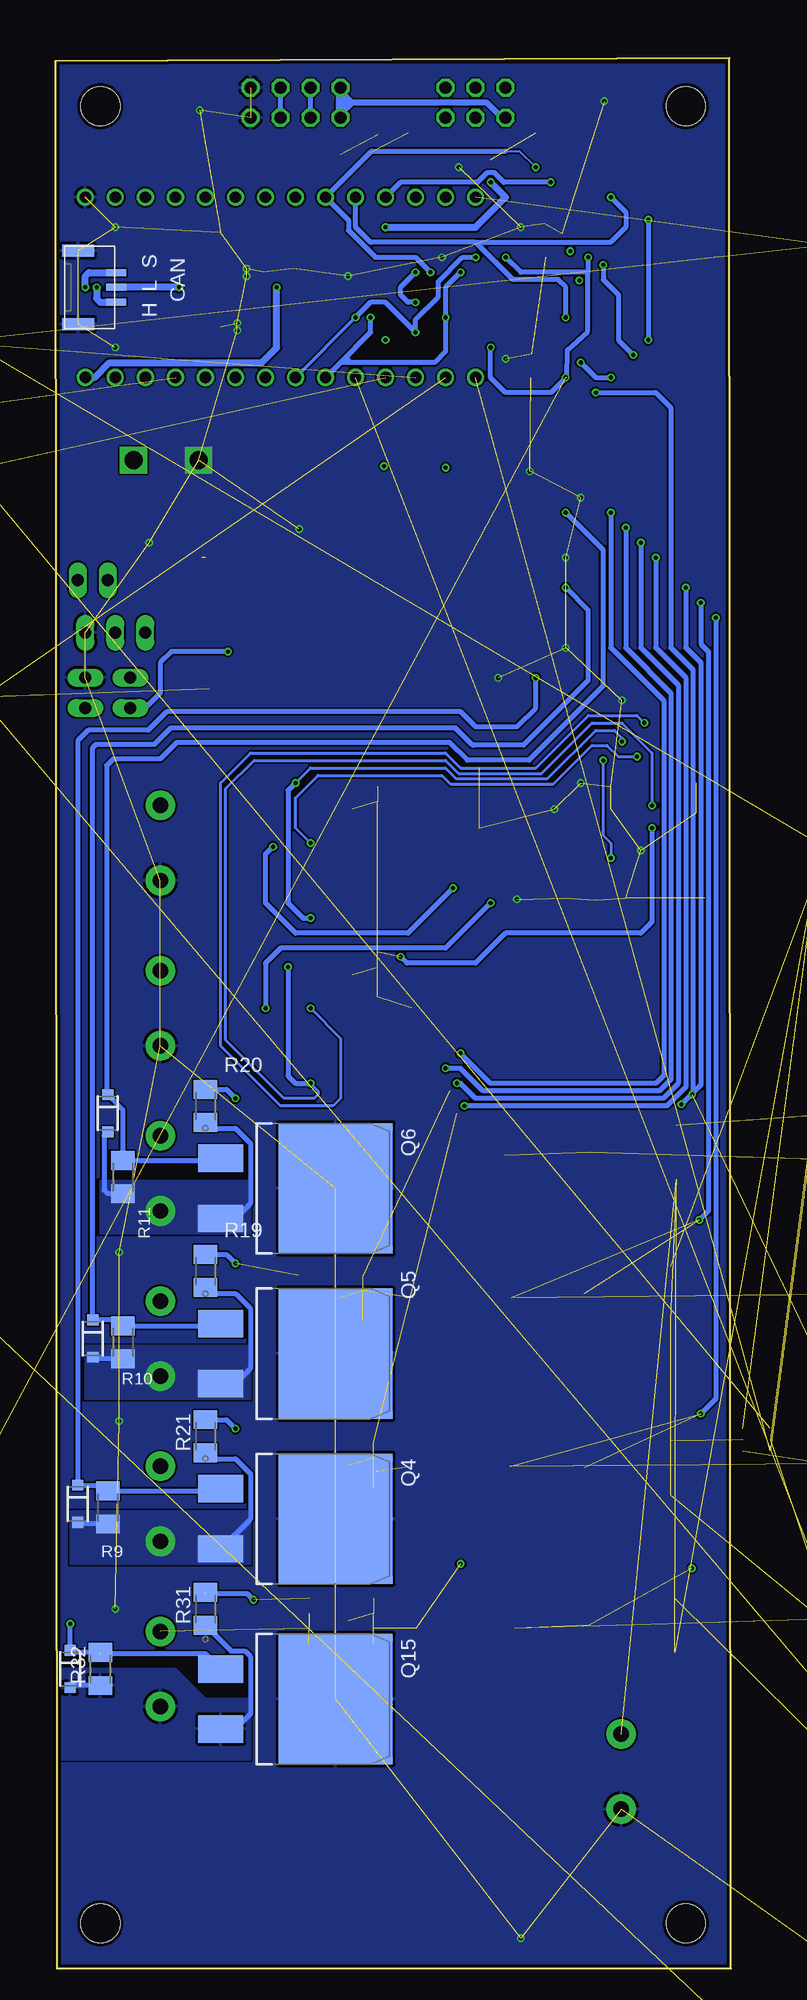
[diagram p7: board, bottom side, seen from below]

Size 57.15 x 161.54 mm. Coordinates in mm from the lower left corner, seen from the top.
Outline: 0.13,161.54 57.15,161.29 57.02,0 0,0 0.13,161.54
Copper layers (1+2*15+16): Top 0.035mm / dielectric 1.5mm / Route2 0.035mm / dielectric 0.15mm / Route15 0.035mm / dielectric 0.2mm / Bottom 0.035mm
Design rules "JLCPCB2Layer *": minimum track width 6mil, minimum drill 10mil, track to track 6mil, track to pad 6mil, pad to pad 6mil, via to via 6mil, smd to smd 0mil, copper to edge 10mil, drill to drill 10mil, minimum pad ring 6mil, minimum via ring 6mil, stop-mask expansion 2mil, vias tented up to drill 100mil, thermal gap 10mil

### Footprints (pad centres in the part's own frame; a part is rotated, then mirrored left to right if it is on the bottom)
1206 = smd 1.6 x 1.803: A -1.422,0; C 1.422,0
C2012 = smd 1.3 x 1.5: 1 -0.85,0; 2 0.85,0
C0805 = smd 1.3 x 1.5: 1 -0.95,0; 2 0.95,0
C0805' = smd 1.3 x 1.5: 1 -0.85,0; 2 0.85,0
C1206 = smd 1.6 x 1.8: 1 -1.4,0; 2 1.4,0
5566-2 = drill 1.524 square: 1 0,-2.756; 2 0,2.756
SM03B-GHS-TB = smd 0.6 x 1.7: P$1 -1.25,0.85; P$2 0,0.85; P$3 1.25,0.85 | smd 1 x 2.7: P$4 -3.1,-2.35; P$5 3.1,-2.35
SOD-123 = smd 0.9 x 0.95: P$1 -1.575,0; P$2 1.575,0
DO-214AC = smd 1.8 x 2.4: A 2.025,0; C -2.025,0
MKDS_5/2-6,35 = drill 1.3 pad 2.5: 1 -3.175,0; 2 3.175,0
1X02 = drill 1.016 long: 1 -1.27,0; 2 1.27,0
1X03 = drill 1.016 long: 1 -2.54,0; 2 0,0; 3 2.54,0
2X03 = drill 1.016 octagon: 1 -2.54,-1.27; 2 -2.54,1.27; 3 0,-1.27; 4 0,1.27; 5 2.54,-1.27; 6 2.54,1.27
2X04 = drill 1.016 octagon: 1 -3.81,-1.27; 2 -3.81,1.27; 3 -1.27,-1.27; 4 -1.27,1.27; 5 1.27,-1.27; 6 1.27,1.27; 7 3.81,-1.27; 8 3.81,1.27
SML0805 = smd 1.2 x 1.2: A 1.05,0; C -1.05,0
SOP-4L = smd 1.3 x 0.9: P$1 -4.75,1.27; P$2 -4.75,-1.27; P$3 4.75,-1.27; P$4 4.75,1.27
SOT404/D2PAK = smd 2.32 x 3.81: 1G -2.54,-6.32; 3S 2.54,-6.32 | smd 11 x 9.65: 2D 0,3.4
SO-8/PPAK/TEST = smd 1.02 x 0.61: D@1 2.795,-1.905; D@2 2.795,-0.635; D@3 2.795,0.635; D@4 2.795,1.905 | smd 3.81 x 3.91: D@5 0.69,0 | smd 1.27 x 0.635: G -2.67,-1.905; S@1 -2.67,1.905; S@2 -2.67,0.635; S@3 -2.67,-0.635
TO252 = smd 1 x 1.6: 1 -2.28,-4.8; 2 2.28,-4.8 | smd 5.4 x 6.2: 3 0,2.5
SOP65P640X120-8N = smd 1.473 x 0.356: 1 -2.921,0.965; 2 -2.921,0.33; 3 -2.921,-0.33; 4 -2.921,-0.965; 5 2.921,-0.965; 6 2.921,-0.33; 7 2.921,0.33; 8 2.921,0.965
R0805 = smd 1.1 x 1.4: 1 -1,0; 2 1,0
3920 = smd 2.7 x 6.2: P$1 -4.15,0; P$2 4.15,0
M1206 = smd 1.6 x 2: 1 -1.4,0; 2 1.4,0
R1206 = smd 1.6 x 1.803: 1 -1.422,0; 2 1.422,0
R0805' = smd 1.3 x 1.5: 1 -0.95,0; 2 0.95,0
HVQFN16_4X4 = smd 0.5 x 0.3: 1 -1.8,0.975; 2 -1.8,0.325; 3 -1.8,-0.325; 4 -1.8,-0.975; 9 1.8,-0.975; 10 1.8,-0.325; 11 1.8,0.325; 12 1.8,0.975 | smd 0.3 x 0.5: 5 -0.975,-1.8; 6 -0.325,-1.8; 7 0.325,-1.8; 8 0.975,-1.8; 13 0.975,1.8; 14 0.325,1.8; 15 -0.325,1.8; 16 -0.975,1.8 | smd 2.25 x 2.25: TH 0,0
TEENSY_3.1_BASIC_2 = drill 0.965: 0 -7.62,13.97; 1 -7.62,11.43; 2 -7.62,8.89; 3 -7.62,6.35; 3.3V 7.62,11.43; 4 -7.62,3.81; 5 -7.62,1.27; 6 -7.62,-1.27; 7 -7.62,-3.81; 8 -7.62,-6.35; 9 -7.62,-8.89; 10 -7.62,-11.43; 11 -7.62,-13.97; 12 -7.62,-16.51; 13 7.62,-16.51; 14/A0 7.62,-13.97; 15/A1 7.62,-11.43; 16/A2 7.62,-8.89; 17/A3 7.62,-6.35; 18/A4 7.62,-3.81; 19/A5 7.62,-1.27; 20/A6 7.62,1.27; 21/A7 7.62,3.81; 22/A8 7.62,6.35; 23/A9 7.62,8.89; AGND 7.62,13.97; GND -7.62,16.51; VIN 7.62,16.51
SO-8 = smd 1.524 x 0.61: 1 -2.692,1.905; 2 -2.692,0.635; 3 -2.692,-0.635; 4 -2.692,-1.905; 5 2.692,-1.905; 6 2.692,-0.635; 7 2.692,0.635; 8 2.692,1.905
20-QFN(4X4) = smd 0.25 x 0.7: !SHDN -0.5,1.9; !VALID1 -1,-1.9; !VALID2 -0.5,-1.9; CAS 0.5,-1.9; EN 0,1.9; GND@1 0,-1.9; HYS -1,1.9; INTVCC 1,-1.9; V1 0.5,1.9; V2 1,1.9 | smd 0.7 x 0.25: G1 1.9,0; G2 1.9,-1; OV1 -1.9,0; OV2 -1.9,-1; TMR -1.9,1; UV1 -1.9,0.5; UV2 -1.9,-0.5; VOUT 1.9,1; VS1 1.9,0.5; VS2 1.9,-0.5 | smd 2.45 x 2.45: GND@2 0,0
MK06A = smd 1.219 x 0.533: 1 -1.168,0.95; 2 -1.168,0; 3 -1.168,-0.95; 4 1.168,-0.95; 5 1.168,0; 6 1.168,0.95
SOIC8 = smd 0.6 x 1.5: 1 -1.905,-2.75; 2 -0.635,-2.75; 3 0.635,-2.75; 4 1.905,-2.75; 5 1.905,2.75; 6 0.635,2.75; 7 -0.635,2.75; 8 -1.905,2.75
STAND-OFF = hole 3.302: 0,0

### Placement (x,y rotation side)
3V1  73.41,41.66 0 top  (outside the outline)
ARVP1  10.16,109.14 90 top
C1  16.51,144.7 180 top
C2  17.78,134.54 180 top
C3  44.13,138.83 180 top
C4  36.99,142.8 90 top
C5  1n  [C0805']  13.97,91.36 270 top
C6  0.1u  [C0805']  8.89,91.36 270 top
C7  0.1u  [C0805']  5.08,91.36 270 top
C8  0.1u  [C0805']  2.22,91.36 270 top
C9  0.1u  [C0805']  3.81,97.71 180 top
C10  0.1u  [C0805']  3.81,100.25 180 top
C13  0.01uF  [C0805']  -23.49,57.15 0 top  (outside the outline)
C14  0.01uF  [C0805']  -7.49,42.67 0 top  (outside the outline)
C15  0.01uF  [C0805']  -13.34,68.2 0 top  (outside the outline)
C16  0.01uF  [C0805']  -14.1,29.72 0 top  (outside the outline)
C17  -15.49,-18.29 0 top  (outside the outline)
C18  1.5uF  [C0805']  40.26,-22.35 0 top  (outside the outline)
CON1  47.78,127.55 90 top
CON2  52.86,142.16 90 top
CON3  52.86,142.16 270 bottom
D1  55.24,39.29 270 bottom
D2  53.98,53.26 270 bottom
D3  52.7,72.31 270 bottom
D4  55.88,25.32 270 bottom
D5  65.41,-20.45 0 top  (outside the outline)
DANGER1  67.69,60.2 0 top  (outside the outline)
J1  48.26,95.17 90 top
J2  48.26,67.23 90 top
J3  48.26,53.26 90 top
J4  48.26,39.29 90 top
J9  48.26,81.2 90 top
J10  48.26,25.32 90 top
J16  9.27,16.64 270 top
JP1  54.61,107.87 90 top
JP2  52.07,112.95 0 top
JP3  50.8,107.87 90 top
JP4  53.98,117.39 180 top
JP5  21.59,157.78 180 top
JP6  36.83,157.78 180 top
LED1  40.64,105.33 0 top
LED2  40.64,102.79 0 top
Q1  36.83,109.14 180 top
Q2  36.83,115.49 180 top
Q3  36.83,121.84 180 top
Q4  36.83,38.02 270 bottom
Q5  36.83,51.99 270 bottom
Q6  36.83,65.96 270 bottom
Q7  33.91,56.69 180 top
Q8  33.02,29.38 180 top
Q9  33.02,42.59 180 top
Q10  38.1,78.34 0 top
Q11  32.7,84.06 180 top
Q12  38.1,92.31 0 top
Q13  32.7,98.03 180 top
Q14  33.02,67.23 180 top
Q15  36.83,22.78 270 bottom
Q16  36.83,128.19 180 top
Q17  9.91,42.34 270 top
Q18  9.91,57.07 270 top
Q19  9.4,69.01 270 top
Q20  9.53,29 270 top
Q21  -31.37,6.73 0 top  (outside the outline)
R1  45.72,111.68 180 top
R2  45.72,114.22 180 top
R3  45.72,116.76 180 top
R4  22.73,56.69 0 top
R5  25.4,110.41 0 top
R6  25.4,116.76 0 top
R7  25.4,123.11 0 top
R8  22.86,42.47 0 top
R9  52.7,38.97 90 bottom
R10  51.43,52.94 90 bottom
R11  51.43,66.91 90 bottom
R12  22.86,81.2 0 top
R13  23.24,68.75 0 top
R14  29.85,157.78 270 top
R15  27.31,157.78 270 top
R16  220  [R0805']  37.62,146.76 0 top
R17  220  [R0805']  37.62,138.83 0 top
R18  1k  [R0805']  44.13,146.76 0 top
R19  44.45,58.98 90 bottom
R20  44.45,72.94 90 bottom
R21  44.45,45.01 90 bottom
R22  20.32,93.9 0 top
R23  16.51,95.17 270 top
R24  20.32,96.44 180 top
R25  20.32,98.98 0 top
R26  16.51,100.25 270 top
R27  20.32,101.52 180 top
R28  11.43,91.36 90 top
R29  44.13,107.23 90 top
R30  46.67,107.23 90 top
R31  44.45,30.4 90 bottom
R32  53.34,25.32 90 bottom
R33  25.4,129.46 0 top
R34  45.72,119.3 180 top
R35  22.48,28.75 0 top
R36  66.04,132.08 0 top  (outside the outline)
R37  75.06,17.91 0 top  (outside the outline)
R41  -8,145.54 0 top  (outside the outline)
R42  65.66,137.41 0 top  (outside the outline)
R43  65.79,126.75 0 top  (outside the outline)
R44  64.9,107.44 0 top  (outside the outline)
R45  81.92,-5.46 0 top  (outside the outline)
R46  1k  [R0805']  -34.16,-2.41 0 top  (outside the outline)
U1  13.97,148.51 90 top
U2  16.51,138.35 90 top
U3  38.1,142.16 270 top
U4  42.23,142.8 0 top
U5  10.16,98.03 180 top
U6  -2.16,44.7 0 top
U7  -8.51,92.84 0 top  (outside the outline)
U8  -35.05,74.04 0 top  (outside the outline)
U10  -13.59,14.35 0 top  (outside the outline)
U12  -22.86,-5.21 0 top  (outside the outline)
U$18  [STAND-OFF]  53.34,157.48 90 top
U$24  [STAND-OFF]  53.34,3.81 90 top
U$25  [STAND-OFF]  3.81,3.81 90 top
U$26  [STAND-OFF]  3.81,157.48 90 top

### Tracks (layer width: path | path; a pad name or v marks a point on that pad's centre or on a via)
!VALID1
  Top 0.254: U5.!VALID1 13.97,102.74 13.97,102.79 LED2.C
!VALID2
  Top 0.254: U5.!VALID2 10.66,100.43 13.65,103.42 31.12,103.42 33.02,105.33 LED1.C
+3V3  (via drill 0.35)  (3 unrouted)
  Top 0.406: U2.4 17.78,136.25 17.78,135.81 18.63,134.96 C2.1 19.69,134.54 20.32,135.18 v20.32,137.08 | U1.4 15.77,146.71 17.36,145.12 C1.1 v19.05,144.7 | U1.16 12.06,147.43 v12.06,144.7 | U2.16 13.97,136.64 v13.97,134.54 | v20.32,137.08 20.03,137.38 U2.5 | v20.32,137.08 28.58,137.08 v29.21,137.72
  Top 0.61: JP5.1 JP5.3 JP5.5 16.99,159.05 16.51,158.58 16.51,155.24 | v20.32,151.05 20.32,152.96 | U3.3.3V 46.67,137.4 44.93,137.4 | 44.93,137.4 29.37,137.4 29.21,137.56 v29.21,137.72 v29.21,147.24 | U4.5 44.92,138.99 C3.1 44.93,138.67 44.93,137.4
  Bottom 0.406: v12.06,144.7 12.06,143.43 17.78,143.43 v19.05,144.7 | v13.97,134.54 15.24,133.27 19.05,133.27 20.32,134.54 v20.32,137.08 | 13.89,134.54 13.83,136.86 12.11,138.43 12.11,143.43
  Bottom 0.61: v20.32,151.05 19.05,149.78 21.59,147.24 v29.21,147.24
+5V  (4 unrouted)
  Top 0.406: JP4.2 52.7,117.08 49.53,113.9 JP2.1 47.99,112.95 R1.1 | R1.1 46.72,108.28 R30.2 R29.2 | R1.1 R2.1 R3.1 R34.1
  Top 1.27: CON1.1 52.7,125.39 JP4.2
BATT1GND
  Bottom 0.406: Q4.3S 40.64,37.99 40.64,41.83 41.91,43.1 43.95,43.1 R21.1 | R9.1 55.1,37.57 D1.P$2
  pour Bottom (no thermals): 55.88,38.66 55.88,34.21 40.64,34.21 40.64,38.66
BATT2GND
  Bottom 0.406: R10.1 53.83,51.54 D2.P$2 | R19.1 43.95,57.07 41.91,57.07 40.64,55.8 40.64,50.72 41.53,49.83 42.77,49.83 Q5.3S
  pour Bottom (no thermals): 54.61,52.62 54.61,48.18 40.64,48.18 40.64,52.62
BATT3GND
  Bottom 0.406: D3.P$2 53.02,70.42 53.02,65.83 52.7,65.51 R11.1 | R20.1 43.95,71.04 41.91,71.04 40.64,69.77 40.64,64.69 41.91,63.42 Q6.3S
  pour Bottom (no thermals): 53.34,66.59 53.34,62.15 40.64,62.15 40.64,66.59
BATT5GND
  Bottom 0.406: R32.1 55.7,23.92 D4.P$2 | R31.1 42.29,26.84 41.1,26.84 40.64,26.38 40.64,21.51 41.91,20.24 42.54,20.88
  pour Bottom: 40.64,22.78 44.45,22.78 46.99,25.32 57.15,25.32 57.15,21.51 57.15,25.32 57.15,17.7 40.64,17.7
BATTERY1  (via drill 0.35)
  Top 0.254: C8.1 2.22,93.58 4.13,95.49 8.89,95.49 9.16,95.76 U5.V2
  Top 0.406: R25.2 22.86,98.98 23.5,98.34 v23.5,91.36 20,87.87 1.91,87.87 0.95,88.82 0.95,91.68 1.48,92.21 C8.1 | v38.73,94.85 38.73,92.37 Q12.D@5
  Bottom 0.406: v23.5,91.36 27.31,87.55 36.83,87.55 39.37,90.09 39.37,94.22 v38.73,94.85
  pour Top (no thermals): 48.89,90.09 37.15,90.09 36.83,90.41 36.83,93.9 44.13,101.2 48.89,101.2 49.53,100.57 49.53,90.72
BATTERY2_IN
  pour Top (no thermals): 49.85,71.67 49.85,62.79 49.21,62.15 35.56,62.15 34.92,62.79 34.92,67.86 35.24,68.18 36.83,68.18 40.96,72.31 49.21,72.31
BATTERY3_IN
  pour Top (no thermals): 49.85,57.71 49.85,48.82 35.81,48.82 35.81,57.49 36.13,57.8 40.42,57.8 40.96,58.34 49.21,58.34
BATTERY4_IN
  pour Top (no thermals): 49.85,43.73 49.85,34.84 49.21,34.21 35.56,34.21 34.92,34.84 34.92,43.23 35.24,43.54 40.13,43.54 40.96,44.37 49.21,44.37
BATTERY5_IN  (3 unrouted)
BATTERY_2  (via drill 0.35)
  Top 0.406: U2.12 15.54,140.59 15.24,140.89 11.43,140.89 11.43,137.08 8.89,134.54 v8.89,121.84 10.16,120.57 Q3.P$4 | v24.13,76.12 24.45,75.8 24.45,68.75 R13.P$2
  Bottom 0.406: v8.89,121.84 8.89,111.68 5.08,107.87 5.08,75.17 6.03,74.21 20.96,74.21 22.86,76.12 v24.13,76.12
  pour Top (no thermals): 34.29,71.67 34.29,62.79 33.66,62.15 26.04,62.15 25.4,62.79 25.4,71.67 26.04,72.31 33.66,72.31
BATTERY_3  (via drill 0.35)  (6 unrouted)
  Top 0.406: U1.15 11.11,148.19 10.77,147.85 10.77,144.09 v10.79,144.06 | v8.26,136.45 7.62,135.81 v7.62,120.57 7.62,118.03 11.43,114.22 Q2.P$4 | v23.18,74.85 23.81,74.21
  Bottom 0.406: v10.79,144.06 10.79,142.81 9.51,141.53 9.51,137.7 v8.26,136.45 | v7.62,120.57 7.62,111.68 4.45,108.5 4.45,74.85 5.71,73.58 21.59,73.58 22.86,74.85 v23.18,74.85
  pour Top: 24.89,59.86 24.89,53.64 25.4,53.13 34.67,53.13 35.18,53.64 35.18,59.86 34.42,60.63 25.65,60.63
BATTERY_4  (via drill 0.35)  (6 unrouted)
  Top 0.406: U1.12 12.99,150.75 12.7,151.05 10.16,151.05 v6.98,147.88 | v6.98,137.72 6.35,137.08 v6.35,119.3 6.35,112.95 12.7,106.6 30.48,106.6 31.75,107.87 Q1.P$4 | v22.54,72.94 23.18,72.31
  Bottom 0.406: v6.98,147.88 v6.98,137.72 | v6.35,119.3 6.35,111.68 3.81,109.14 3.81,74.53 5.4,72.94 v22.54,72.94
  pour Top: 25.27,45.77 25.27,39.29 25.78,38.78 33.66,38.78 34.29,39.42 34.29,46.02 33.91,46.4 25.91,46.4
BATTERY_5  (via drill 0.35)  (6 unrouted)
  Top 0.203: U1.2 13.64,145.26 v13.59,145.21 | v29.34,127.05 31.95,127.05 Q16.P$4
  Route2 0.203: v13.59,145.21 17.15,141.65 17.15,129.84 19.49,127.5 20.57,127.5 24.37,127.5 24.83,127.05 v29.34,127.05
  Route2 0.406: v22.86,34.21 22.86,70.28 20.57,72.56 20.57,79.55 26.8,85.77 26.8,105.71 29.08,108 29.08,116.51 20.57,125.02 20.57,127.5
  pour Top: 24.13,26.29 24.13,31.88 24.77,32.51 34.29,32.51 34.42,32.39 34.54,32.26 34.54,25.78 33.91,25.15 25.27,25.15
CAN_RX1
  Top 0.305: U4.4 39.53,139.79 R17.2
CAN_RX_T
  Top 0.305: R17.1 34.88,140.62 34.88,146.87 36.38,148.38 40.51,148.38 U3.4
CAN_TX2
  Top 0.305: U4.1 39.53,145.8 R16.2
CAN_TX_T
  Top 0.305: U3.3 42.54,147.87 37.78,147.87 37.57,147.66 R16.1
CANH1  (via drill 0.35)
  Top 0.61: U4.7 51.99,143.43 CON2.P$3 53.36,143.41 53.66,143.11 v53.66,142.16
  Bottom 0.61: v53.66,142.16 53.66,141.21 53.34,140.89 52.03,140.89 CON3.P$3
CANL1  (via drill 0.35)
  Top 0.61: U4.6 v46.67,142.16 CON3.P$2
  Bottom 0.61: v46.67,142.16 CON3.P$2
CANSH1  (via drill 0.35)
  Top 0.61: CON2.P$1 54.31,140.91 54.61,141.21 v54.61,142.16
  Bottom 0.61: v54.61,142.16 54.61,143.11 54.31,143.41 CON3.P$1
CRITICAL_OUT  (via drill 0.35)
  Top 0.406: U1.9 14.95,150.75 v15.24,151.05 | U2.9 17.49,141 18.03,141.55 24.79,141.55 25.4,142.16 26.67,142.16 27.94,143.43 27.94,147.24 29.21,148.51 U3.9
  Bottom 0.406: v15.24,151.05 19.21,151.05 20,151.84 20.65,151.84 21.43,151.05 27.94,151.05 U3.9
E1
  Top 0.406: R5.2 Q1.P$3
E2
  Top 0.406: R6.2 Q2.P$3
E3
  Top 0.406: R7.2 Q3.P$3
ELECTRONICS_BATTERY  (via drill 0.35)  (11 unrouted)
  Top 0.254: U5.VOUT 7.25,97.03 v6.67,96.44
  Top 0.406: U2.15 14.67,138.06 13.97,138.06 13.33,137.43 13.33,136.45 v12.7,135.81 | v10.16,134.54 v10.16,123.11 | v22.86,77.39 24.45,78.98 24.45,80.56 25.08,81.2 R12.P$2
  Bottom 0.406: v10.16,134.54 11.43,134.54 v12.7,135.81 | v10.16,123.11 10.16,111.68 5.69,107.21 5.69,75.51 6.35,74.85 20.32,74.85 v22.86,77.39 | v6.67,96.44 6.67,88.5 7.62,87.55 19.05,87.55 21.59,85.01 27.4,85.01 v27.94,85.55
  pour Top (no thermals): 29.21,100.25 33.66,100.25 33.97,99.93 33.97,76.75 33.34,76.12 25.72,76.12 25.08,76.75 25.08,96.12
G1  (via drill 0.35)
  Top 0.254: U5.G1 6.98,98.03 v6.67,98.34
  Top 0.406: v35.56,74.85 35.43,74.98 Q10.G | Q11.G 37.15,85.96 37.46,85.64 v37.46,84.69
  Bottom 0.254: v35.56,74.85 34.92,74.21 34.92,73.9 35.24,73.58 37.78,73.58 42.72,78.52 42.72,99.75 40.32,102.16 24.14,102.16 23.05,101.06 16.02,101.06 11.75,105.33 9.21,105.33 6.67,102.79 v6.67,98.34
  Bottom 0.406: v37.46,84.69 37.46,75.48 36.83,74.85 v35.56,74.85
  pour Top (no thermals): 35.24,86.91 34.61,86.28 34.61,85.64 36.83,85.64 36.83,83.74 38.1,83.74 38.1,86.28 37.46,86.91
  pour Top (no thermals): 34.61,74.85 35.24,74.21 36.2,74.21 36.2,76.75 34.61,76.75
G2  (via drill 0.35)
  Top 0.254: U5.G2 8.26,100.89 9.21,101.84 v9.21,103.74
  Top 0.406: Q13.G 36.51,99.93 v36.83,100.25 | v35.56,88.82 35.56,90.28 Q12.G
  Bottom 0.254: v36.83,100.25 35.56,101.52 24.15,101.52 23.24,100.61 15.52,100.61 11.43,104.69 9.84,104.69 9.21,104.06 v9.21,103.74
  Bottom 0.406: v36.83,100.25 37.46,99.61 37.46,90.09 36.2,88.82 v35.56,88.82
  pour Top (no thermals): 35.24,100.88 34.61,100.25 34.61,99.61 37.78,99.61 37.78,100.57 37.46,100.88
  pour Top (no thermals): 34.61,88.82 35.24,88.18 36.2,88.18 36.2,90.72 34.61,90.72
GATE1  (1 unrouted)
GATE2  (1 unrouted)
GATE3  (1 unrouted)
GATE4  (1 unrouted)
GATE5  (1 unrouted)
GND  (via drill 0.35)  (74 unrouted)
  Top 0.254: C1.2 15.56,144.73 14.3,144.67 14.3,144.51 U1.3
  Top 0.406: U2.3 16.84,134.64 C2.2
  other vias: 41.75,139.14 41.75,138.51 40.96,143.75 40.96,143.11 23.02,152.32 44.93,157.15 17.78,2.54 52.07,30.4 52.07,137.08 52.07,147.24 10.71,157.91 7.62,94.53 18.1,90.41 14.92,98.03 12.7,124.38 13.97,111.68 19.69,109.14 49.21,120.57 36.51,121.71 17.02,126.6 19.05,136.13 17.78,147.24 32.38,143.11 24.45,144.7 9.21,107.23 51.75,60.56 51.75,46.27 12.7,100.25 13.97,119.3
  pour Top (no thermals): 47.15,126.13 47.15,128.98 43.02,128.98 43.02,126.13
  pour Bottom (no thermals): 47.15,126.13 47.15,128.98 43.02,128.98 43.02,126.13
  pour Bottom (rank 2): 56.83,0.32 56.83,160.97 0.32,160.97 0.32,0.32
  pour Top (rank 3): 56.83,0.32 56.83,160.97 0.32,160.97 0.32,0.32
HYS
  Top 0.254: R28.2 11.16,92.63 U5.HYS
I2C_3V1
  Bottom 0.508: JP5.6 19.37,156.51 20.64,157.78 33.02,157.78 | 33.02,158.73 32.07,157.78 33.02,156.83
  Bottom 0.813: JP6.7 33.02,158.73 33.02,157.78 33.02,156.83 JP6.8
IO1  (1 unrouted)
IO2  (4 unrouted)
IO3  (2 unrouted)
IO4  (2 unrouted)
IO5  (2 unrouted)
IO6  (2 unrouted)
LED_D  (1 unrouted)
MG1  (via drill 0.35)
  Top 0.406: R5.1 17.78,110.41 v16.51,109.14
  Bottom 0.406: v16.51,109.14 16.51,106.6 18.1,105.01 21.59,105.01 22.86,106.28 47.71,106.28 49.28,104.72 54.36,104.72 55.24,103.83 D1.P$1 53.2,40.87 R9.2 43.34,40.37 Q4.1G
MG2  (via drill 0.35)
  Top 0.406: R6.1 v13.97,116.76
  Bottom 0.406: v13.97,116.76 12.09,114.88 12.09,108.89 17.53,103.45 21.84,103.45 23.29,104.9 47.38,104.9 48.77,103.5 53.72,103.5 54.03,103.2 54.03,54.89 D2.P$1 51.93,54.84 R10.2 43.34,54.34 Q5.1G
MG3  (via drill 0.35)
  Top 0.406: R7.1 v13.97,123.11
  Bottom 0.406: v13.97,123.11 10.82,119.96 10.82,108.43 17.07,102.18 22.3,102.18 23.8,103.68 46.87,103.68 48.27,102.28 52.26,102.28 52.81,101.74 52.81,73.99 D3.P$1 51.43,72.61 R11.2 43.34,68.31 Q6.1G
MG4  (via drill 0.35)  (1 unrouted)
  Top 0.406: v24.13,126.92 24,127.05 R33.1
  Route2 0.406: v24.13,126.92 25.4,125.65 33.02,125.65 34.29,124.38 34.29,114.22 44.45,104.06 53.34,104.06 55.88,101.52 v55.88,29.13
  Bottom 0.406: Q15.1G 44.42,26.59 53.34,26.59 | R32.2 55.7,26.72 D4.P$1 v55.88,29.13
MOTOR1  (via drill 0.35)  (4 unrouted)
  Top 0.406: U1.11 13.61,150.35 13.61,151.01 12.95,151.66 9.5,151.66 7.62,149.78 2.54,149.78 1.27,148.51 v1.27,114.22
  Bottom 0.406: v2.54,46.91 1.27,48.18 v1.27,114.22
  pour Top: 8.26,47.29 19.94,47.29 20.83,46.4 20.83,38.27 20.19,37.64 7.87,37.64 7.11,38.4 7.11,46.15
MOTOR2  (via drill 0.35)  (4 unrouted)
  Top 0.406: U1.14 10.48,148.84 9.53,147.88 9.53,144.06 7.62,142.16 3.81,142.16 2.54,140.89 v2.54,115.49
  Bottom 0.406: v2.67,63.29 1.91,64.05 1.91,111.36 2.54,112 v2.54,115.49
  pour Top (no thermals): 19.94,51.86 8.51,51.86 7.87,52.5 7.87,60.75 8.51,61.39 19.94,61.39 20.57,60.75 20.57,52.5
MOTOR3  (via drill 0.35)  (3 unrouted)
  Top 0.406: U2.11 16.19,141.22 15.85,141.55 6.35,141.55 3.81,139.01 v3.81,116.76 | R13.P$1 20.96,68.75 20.96,71.99 20,72.94 4.32,72.94 v4.19,73.07
  Bottom 0.406: v3.81,116.76 3.81,111.68 2.54,110.41 2.54,74.72 v4.19,73.07
  pour Top (no thermals): 19.43,63.8 8.64,63.8 7.62,64.82 7.62,71.67 8.26,72.31 19.69,72.31 20.32,71.67 20.32,64.69
MOTOR4  (via drill 0.35)  (4 unrouted)
  Top 0.203: v12.83,142.75 12.83,146.54 U1.1
  Route2 0.203: v3.3,33.83 3.3,71.36 3.23,71.43 3.23,73.03 3.86,73.66 3.86,115.89 3.23,116.52 3.23,136.37 9.6,142.75 v12.83,142.75
  pour Top: 6.73,28.96 6.73,32.39 7.62,33.27 7.75,33.4 19.81,33.4 21.21,32 21.21,26.04 19.3,24.13 7.62,24.13 6.86,24.89 6.73,25.02
N$1
  Top 0.406: R1.2 41.58,108.54 Q1.P$1
N$2
  Top 0.406: R2.2 Q2.P$1
N$3
  Top 0.406: R3.2 41.58,119.9 Q3.P$1
N$4  (via drill 0.35)
  Top 0.406: JP3.1 JP1.1 | v42.54,111.36 42.53,111.36 Q1.P$2 40,112 40,115.18 Q2.P$2 40,118.33 40,121.53 Q3.P$2 40.64,123.11 39.37,124.38 39.37,127.25 Q16.P$2
  Bottom 0.406: v42.54,111.36 47.31,111.36 48.26,110.41 48.26,107.87 49.53,106.6 JP3.1
N$5
  Top 0.406: JP2.2 52.07,110.41 JP3.2
N$6  (via drill 0.35)  (1 unrouted)
  Bottom 0.406: R19.2 42.67,60.38 v41.91,59.61
N$7  (via drill 0.35)
  Top 0.406: v41.91,73.58 40.64,73.58 36.2,69.13 Q14.G
  Bottom 0.406: R20.2 42.67,74.34 v41.91,73.58
N$8
  Top 0.406: R29.1 43.23,105.33 LED1.A
N$9  (via drill 0.35)
  Top 0.406: Q9.G 36.83,45.64 v41.91,45.64
  Bottom 0.406: R21.2 42.67,46.41 v41.91,45.64
N$10  (via drill 0.35)  (2 unrouted)
  Bottom 0.406: v40.39,31.16 40.89,31.67 44.45,31.67
N$11
  Top 0.406: R30.1 43.23,102.79 LED2.A
N$14
  Top 0.254: C5.1 12.06,94.12 U5.TMR
N$15
  Top 0.406: R33.2 Q16.P$3
N$16  (1 unrouted)
  Top 0.406: Q16.P$1 41.58,124.71 42.59,123.71 42.59,123.7 44.45,121.84 44.45,119.3
N$18  (1 unrouted)
N$19  (2 unrouted)
N$20  (1 unrouted)
N$21  (1 unrouted)
N$22  (1 unrouted)
N$23  (1 unrouted)
NIU  (via drill 0.35)
  Top 0.254: U5.!SHDN U5.EN v10.16,93.9 8.89,92.63 C6.1 | U5.INTVCC 9.16,100.52 v10.79,102.16
  Bottom 0.254: v10.16,93.9 10.16,95.17 10.79,95.8 v10.79,102.16
OV1
  Top 0.254: U5.OV1 12.1,97.98 13.07,97.98 13.79,97.26 13.79,96.62 14.29,96.12 16.46,96.12 R23.1
  Top 0.406: R24.2 16.78,96.44 R23.1
OV2
  Top 0.254: U5.OV2 12.75,99.03 14.97,101.25 R26.1
  Top 0.406: R27.2 16.78,101.52 R26.1
POWER_BOARD  (via drill 0.35)  (7 unrouted)
  Top 0.406: U2.14 13.03,138.68 12.7,138.35 12.7,137.08 11.43,135.81 v11.43,133.27 13.97,133.27 15.54,134.84 U2.1 | R12.P$1 20.32,81.2 20.96,80.56 20.96,76.12 18.42,73.58 3.59,73.58 v3.27,73.9
  Bottom 0.406: v11.43,133.27 6.35,133.27 5.08,132 5.08,111.68 3.17,109.77 3.17,74 v3.27,73.9
  pour Top (no thermals): 19.69,76.12 8.26,76.12 7.62,76.75 7.62,86.6 8.26,87.23 19.69,87.23 20.32,86.6 20.32,76.75
PV_OUT  (via drill 0.35)
  Top 0.406: U1.10 14.29,151.38 15.24,152.32 v16.51,152.32 | U2.10 16.84,141.22 17.78,142.16 24.13,142.16 v25.4,143.43
  Bottom 0.152: 19.05,153.68 17.87,153.68 v16.51,152.32
  Bottom 0.406: v25.4,143.43 26.67,144.7 30.07,144.7 32.36,146.99 32.36,147.85 U3.7 30.39,153.68 19.05,153.68
SCL  (via drill 0.35)  (1 unrouted)
  Top 0.305: v31.75,139.62 30.99,140.38 30.99,147.27 33.02,149.3 33.02,153.44 | JP6.6 34.44,155.39 32.56,155.39 31.59,156.36 R14.2 29.85,155.09
  Top 0.406: U2.6 26.35,138.03 v26.67,138.35 | U1.6 18.92,148.19 19.82,147.29 20.27,147.29 21.59,145.97 v21.59,144.7
  Bottom 0.305: v31.75,139.62 U3.19/A5
  Bottom 0.406: JP6.6 JP6.5 | v31.75,139.62 30.48,140.89 29.21,140.89 v26.67,138.35 26.67,139.46 24.74,141.39 24.74,142.66 22.7,144.7 v21.59,144.7
SCL_3V1
  Top 0.406: JP5.2 25.4,157.78 28.26,157.78 29.68,159.2 R14.1
SDA  (via drill 0.35)  (1 unrouted)
  Top 0.305: v30.48,139.62 30.48,153.59 | JP6.4 36.83,157.78 29.05,157.78 27.63,156.36 R15.2 27.31,155.24
  Top 0.406: U2.7 19.69,138.68 19.98,138.96 22.84,138.96 23.5,139.62 v24.13,139.62 | U1.7 19.13,148.84 20.07,147.9 22.2,147.9 22.86,147.24 v22.86,143.43
  Bottom 0.305: 32.38,136.45 30.48,138.35 | 32.7,136.13 32.38,136.45 | 32.7,136.13 33.02,135.81 | 32.38,136.13 32.38,136.45 | 32.38,136.13 32.38,135.81 32.7,136.13 | 31.75,135.81 32.07,135.81 32.38,136.13
  Bottom 0.406: JP6.4 JP6.3 | 33.02,135.81 32.38,135.81 31.75,135.81 25.08,135.81 24.13,136.76 v24.13,139.62 24.13,142.16 v22.86,143.43 | 33.02,135.81 U3.18/A4 | 33.02,135.81 30.48,138.35 v30.48,139.62
SDA_3V1
  Top 0.406: JP5.4 22.96,157.88 24.61,157.88 25.93,159.2 R15.1
STB1
  Top 0.305: R18.2 44.92,146.6 U4.8
TC_OUT  (via drill 0.35)
  Top 0.406: U1.13 11.88,149.78 v10.16,149.78 | U2.13 14.27,139.33 v13.97,139.62
  Bottom 0.406: v10.16,149.78 8.89,148.51 8.89,147.24 10.16,145.97 21.59,145.97 | 21.59,145.97 30.48,145.97 31.75,147.24 U3.8 | v13.97,139.62 13.97,142.16 14.63,142.82 17.78,142.82 18.44,142.82 21.59,145.97
UV1
  Top 0.254: R23.2 14.97,94.17 13.33,95.8 13.33,97.07 12.88,97.53 U5.UV1
  Top 0.406: R23.2 18.63,94.17 R22.1
UV2
  Top 0.254: U5.UV2 13.52,98.53 14.24,99.25 R26.2
  Top 0.406: R25.1 16.78,98.98 R26.2
VIN  (via drill 0.35)
  Top 0.61: U4.3 v38.42,142.16 37.15,142.16 36.95,141.88 C4.1
  Top 1.27: U3.VIN 55.24,133.91 JP4.1
  Bottom 0.61: U3.VIN 53.83,134.54 52.59,135.78 39.71,135.78 38.42,137.08 v38.42,142.16
VOUT  (11 unrouted)
VS1  (via drill 0.35)
  Top 0.254: U5.VS1 4.84,97.53 C9.1 4.66,97.88 3.56,98.98 1.91,98.98 1.27,99.61 1.27,102.79 3.81,105.33 v7.3,105.33 | Q11.S@1 35.37,81.39 v35.56,81.2
  Bottom 0.254: v35.56,81.2 33.02,78.66 33.02,73.58 33.66,72.94 38.1,72.94 43.18,78.02 43.18,100.25 40.64,102.79 24.13,102.79 22.86,101.52 16.51,101.52 12.06,105.96 7.94,105.96 v7.3,105.33
  pour Top (no thermals): 34.61,85.01 36.2,85.01 36.2,77.39 34.61,77.39
VS2  (via drill 0.35)
  Top 0.254: U5.VS2 7.82,98.53 7.58,98.77 7.58,99.02 6.35,100.25 C10.1 4.66,101.42 5.71,102.47 v7.94,102.47
  Top 0.406: Q13.S@1 35.37,95.36 v35.56,95.17
  Bottom 0.254: v35.56,95.17 36.83,96.44 36.83,98.98 34.92,100.88 24.45,100.88 23.71,100.15 15.02,100.15 11.75,103.42 10.48,103.42 9.53,102.47 v7.94,102.47
  pour Top (no thermals): 34.61,98.98 36.2,98.98 36.2,91.36 34.61,91.36
WALL  (via drill 0.35)
  Top 0.254: U5.V1 9.66,94.99 8.26,93.58 5.82,93.58 5.08,92.84 C7.1
  Top 0.406: R22.2 21.74,91.51 v20.32,90.09 19.05,88.82 7.62,88.82 6.98,89.45 6.98,91.36 6.13,92.21 C7.1 | v39.37,81.2 39.37,78.92 Q10.D@5
  Bottom 0.406: v39.37,81.2 39.37,85.01 38.1,86.28 24.13,86.28 v20.32,90.09
  pour Top (no thermals): 48.89,76.12 37.46,76.12 36.83,76.75 36.83,79.93 44.13,87.23 48.89,87.23 49.53,86.6 49.53,76.75
WARNING_OUT  (via drill 0.35)
  Top 0.406: U1.8 19.35,149.49 20.32,148.51 25.4,148.51 | U3.10 25.4,148.51 | U2.8 18.76,139.33 20.32,140.89 v26.67,140.89 | v26.67,143.43 25.4,144.7 25.4,148.51
  Bottom 0.406: v26.67,140.89 27.31,140.89 27.94,141.53 27.94,142.16 v26.67,143.43
(copper drawn outside any net)
  shapes: Top area x3

### Text on the board
tPlace: ARVP BATTERY VOLTAGE MONITORING | REV 1.2 12/2017 | M. Blenkinsopp | M. Farow | E Battery | WALL
tNames: I2C | I2C / PWR | 3V3 | SDA | SCL | 3V3 | SCL | SDA | GND | 3V3 | SHORT JP4 / WHEN USB NOT / IN USE | H | CAN | L | S | + / E.B / - | + / W / - | + / PB / - | + / M / - | + / B2 / - | + / M / - | + / B3 / - | + / M / - | + / B4 / - | MAX 40A/BATTERY
bNames: S | CAN | L | H